# Altium schematic sheet SixPak Ultra.SchDoc
size 863 x 558 mm; SheetNumber: 1; SheetTotal: 1
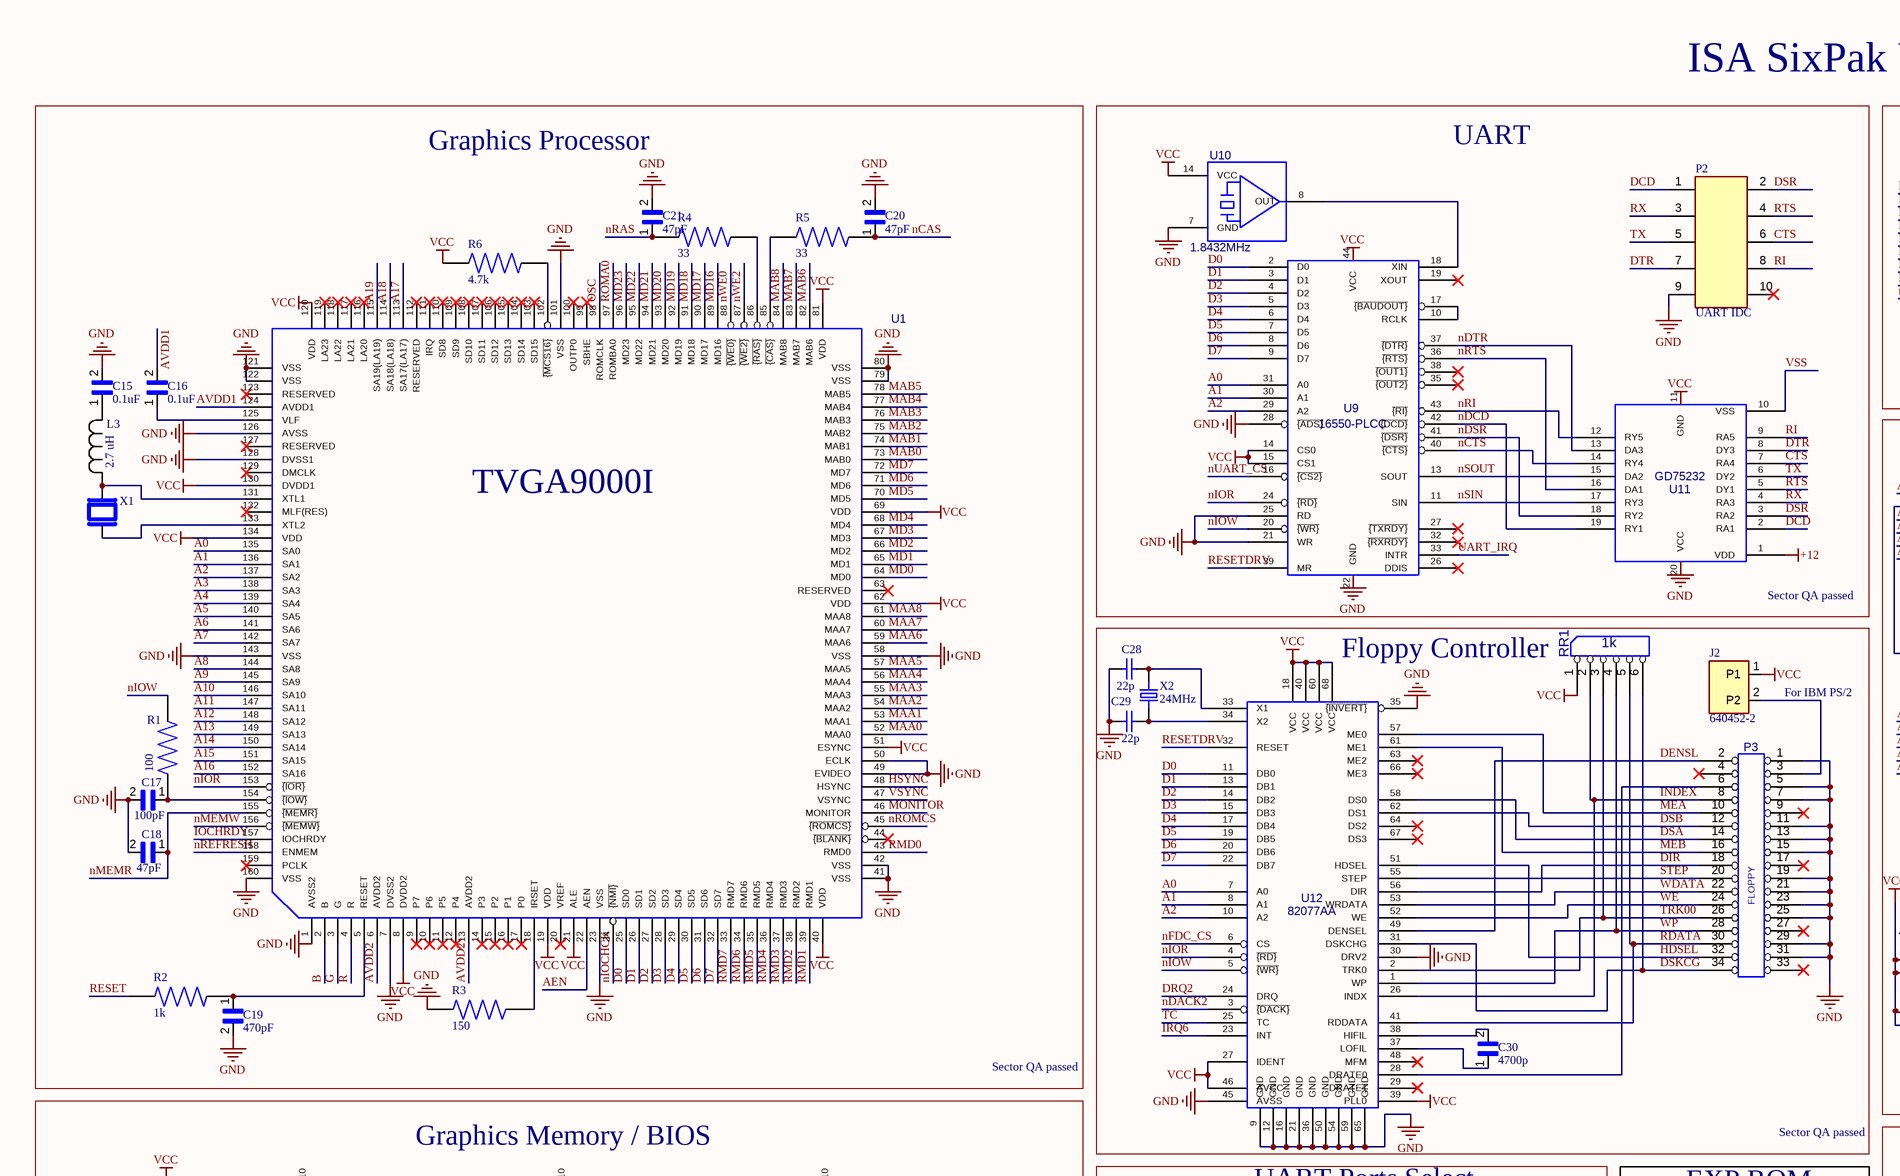
[diagram p0: SixPak Ultra.SchDoc, top left]
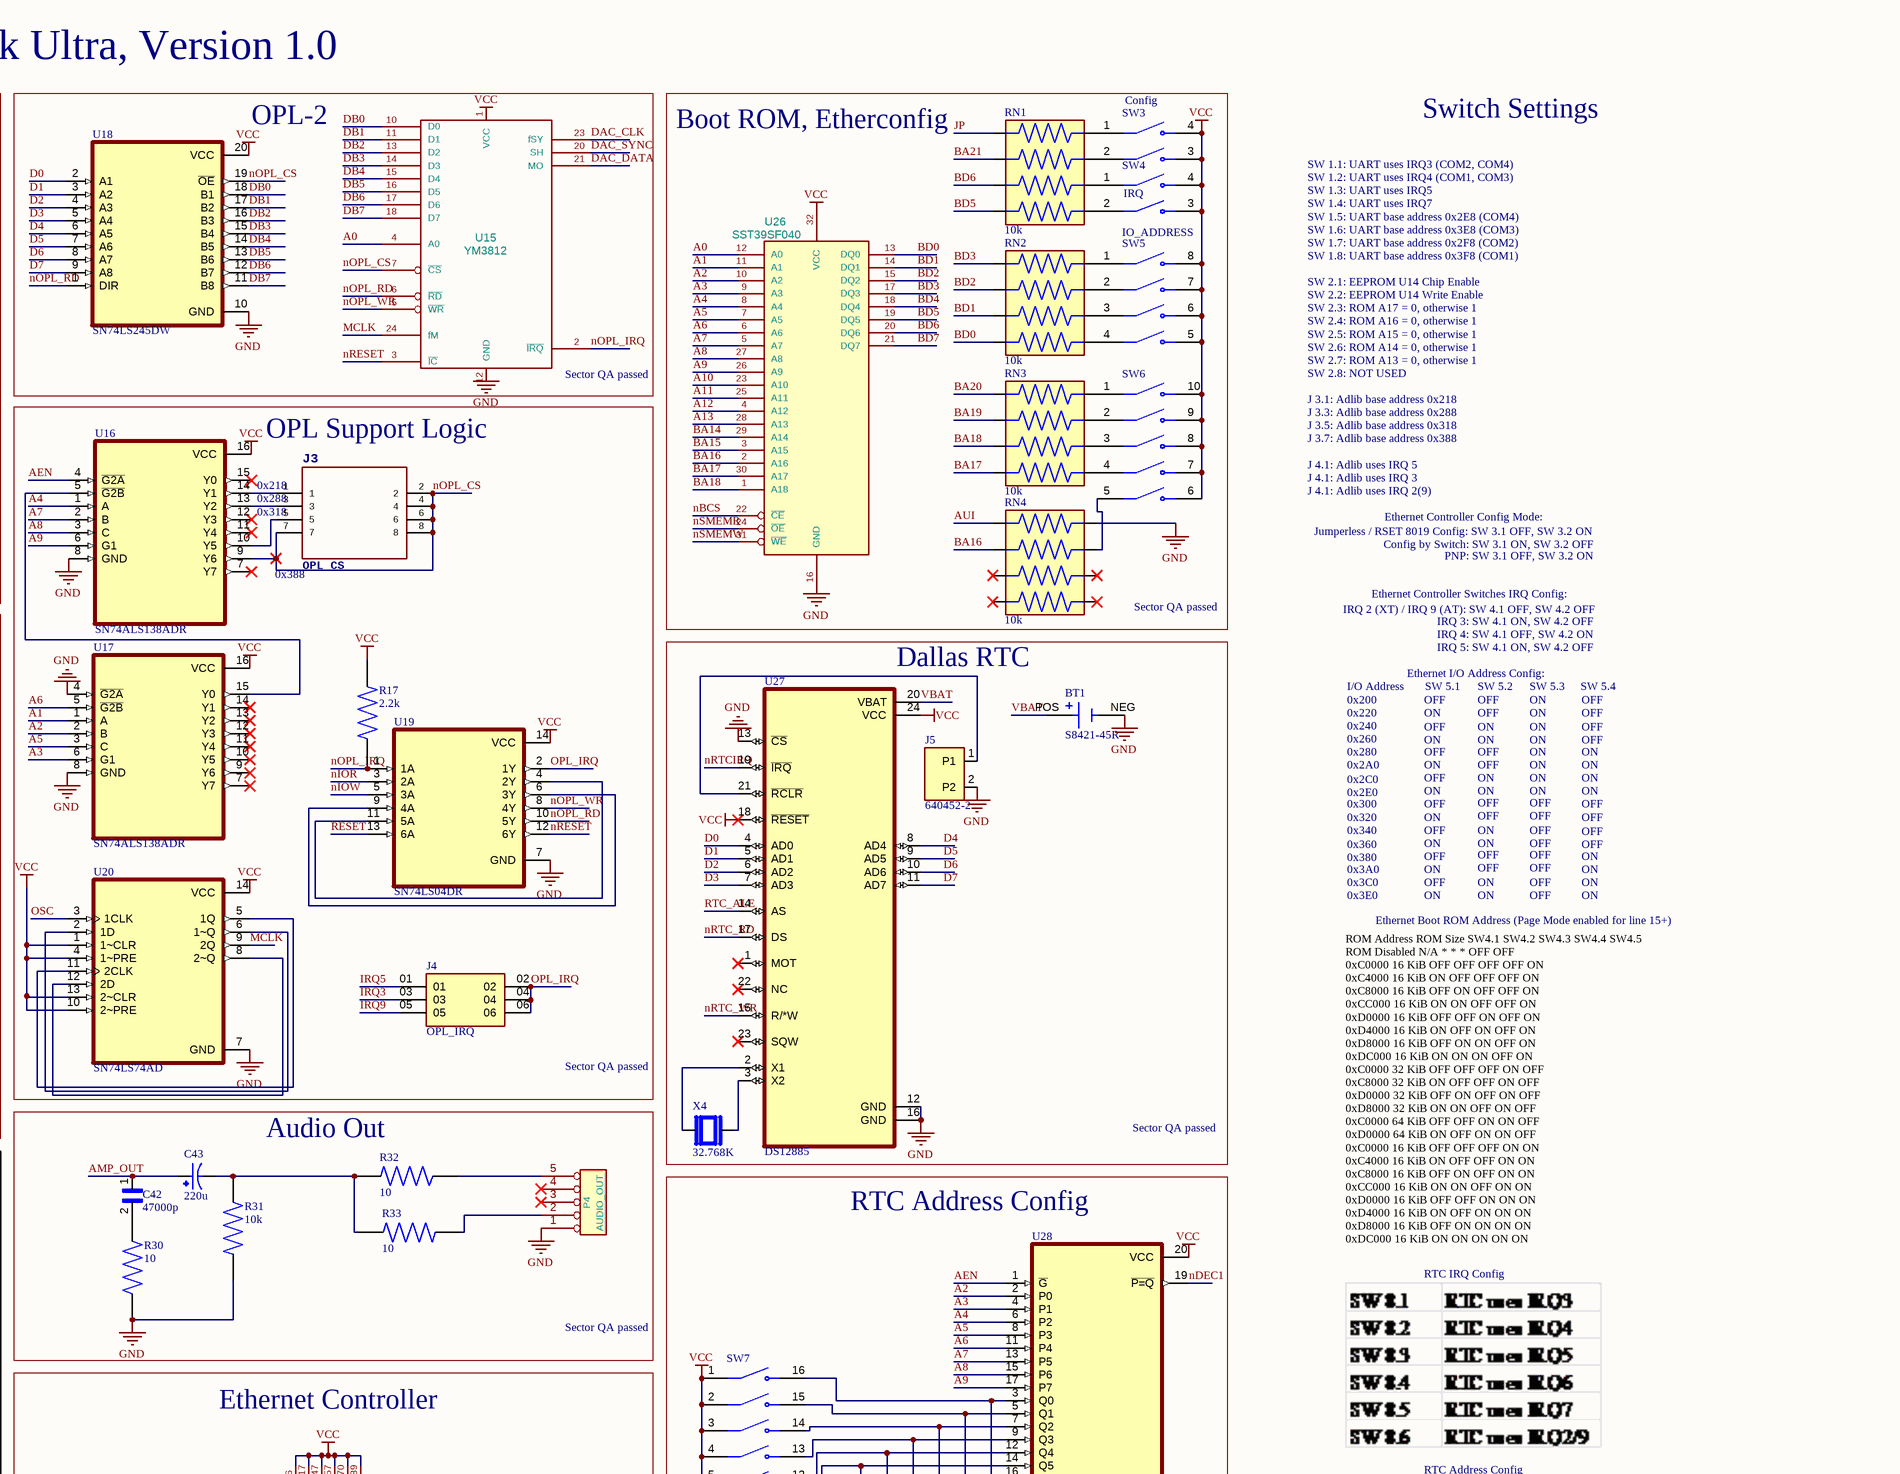
[diagram p1: SixPak Ultra.SchDoc, top right]
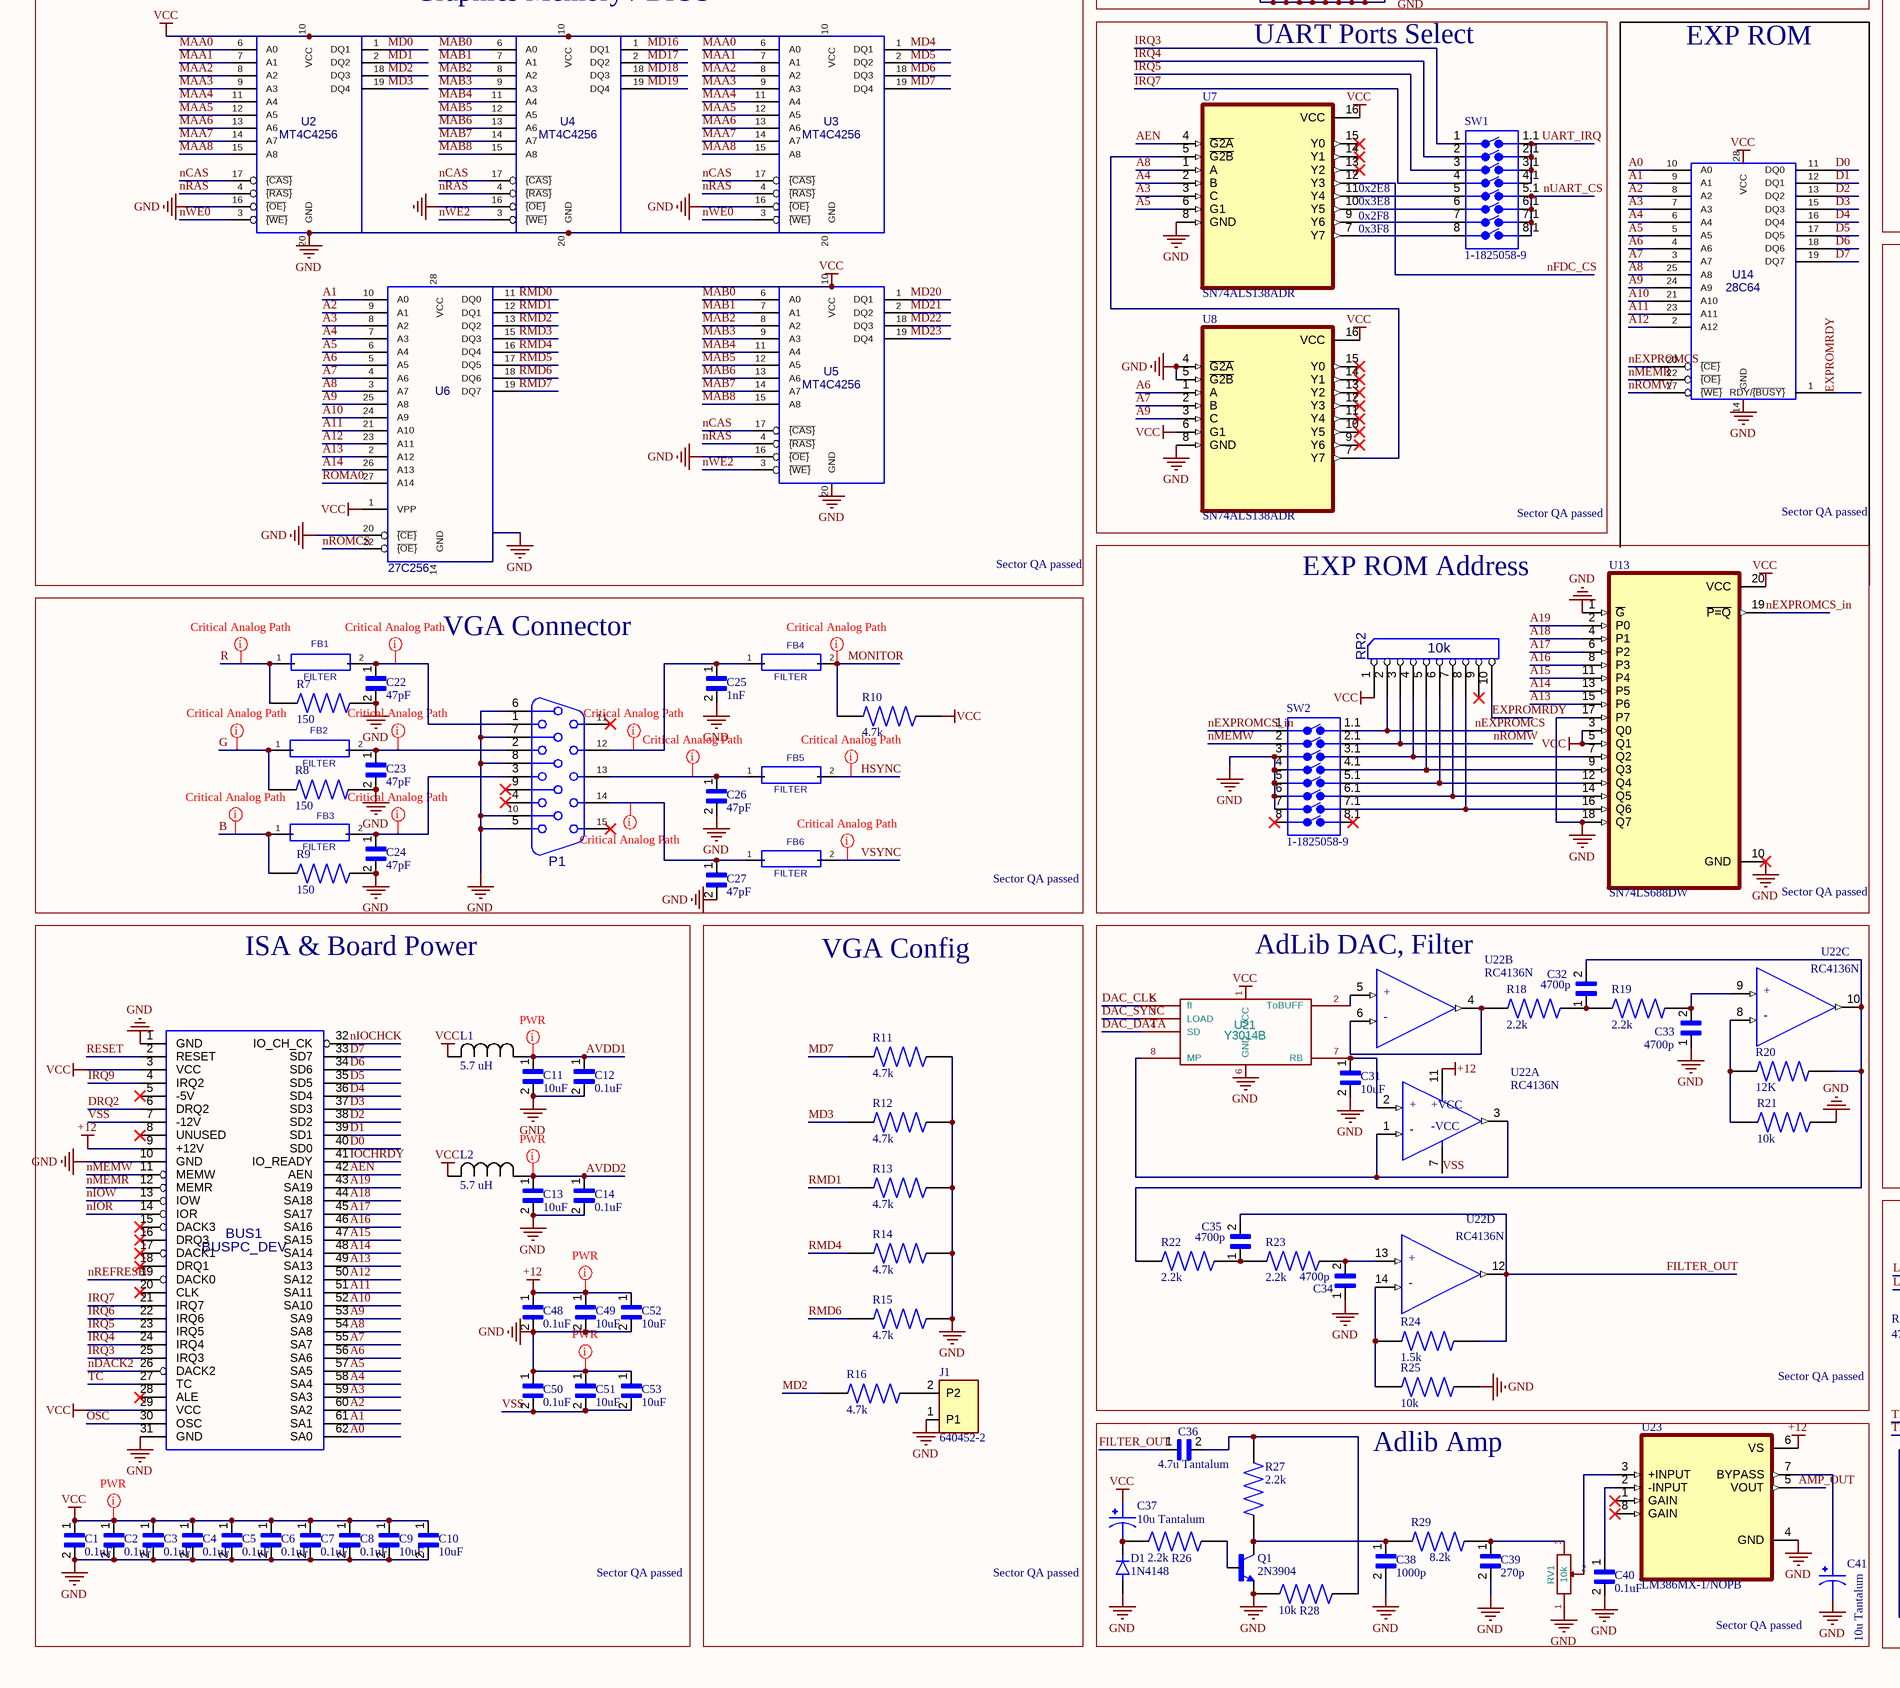
[diagram p2: SixPak Ultra.SchDoc, bottom left]
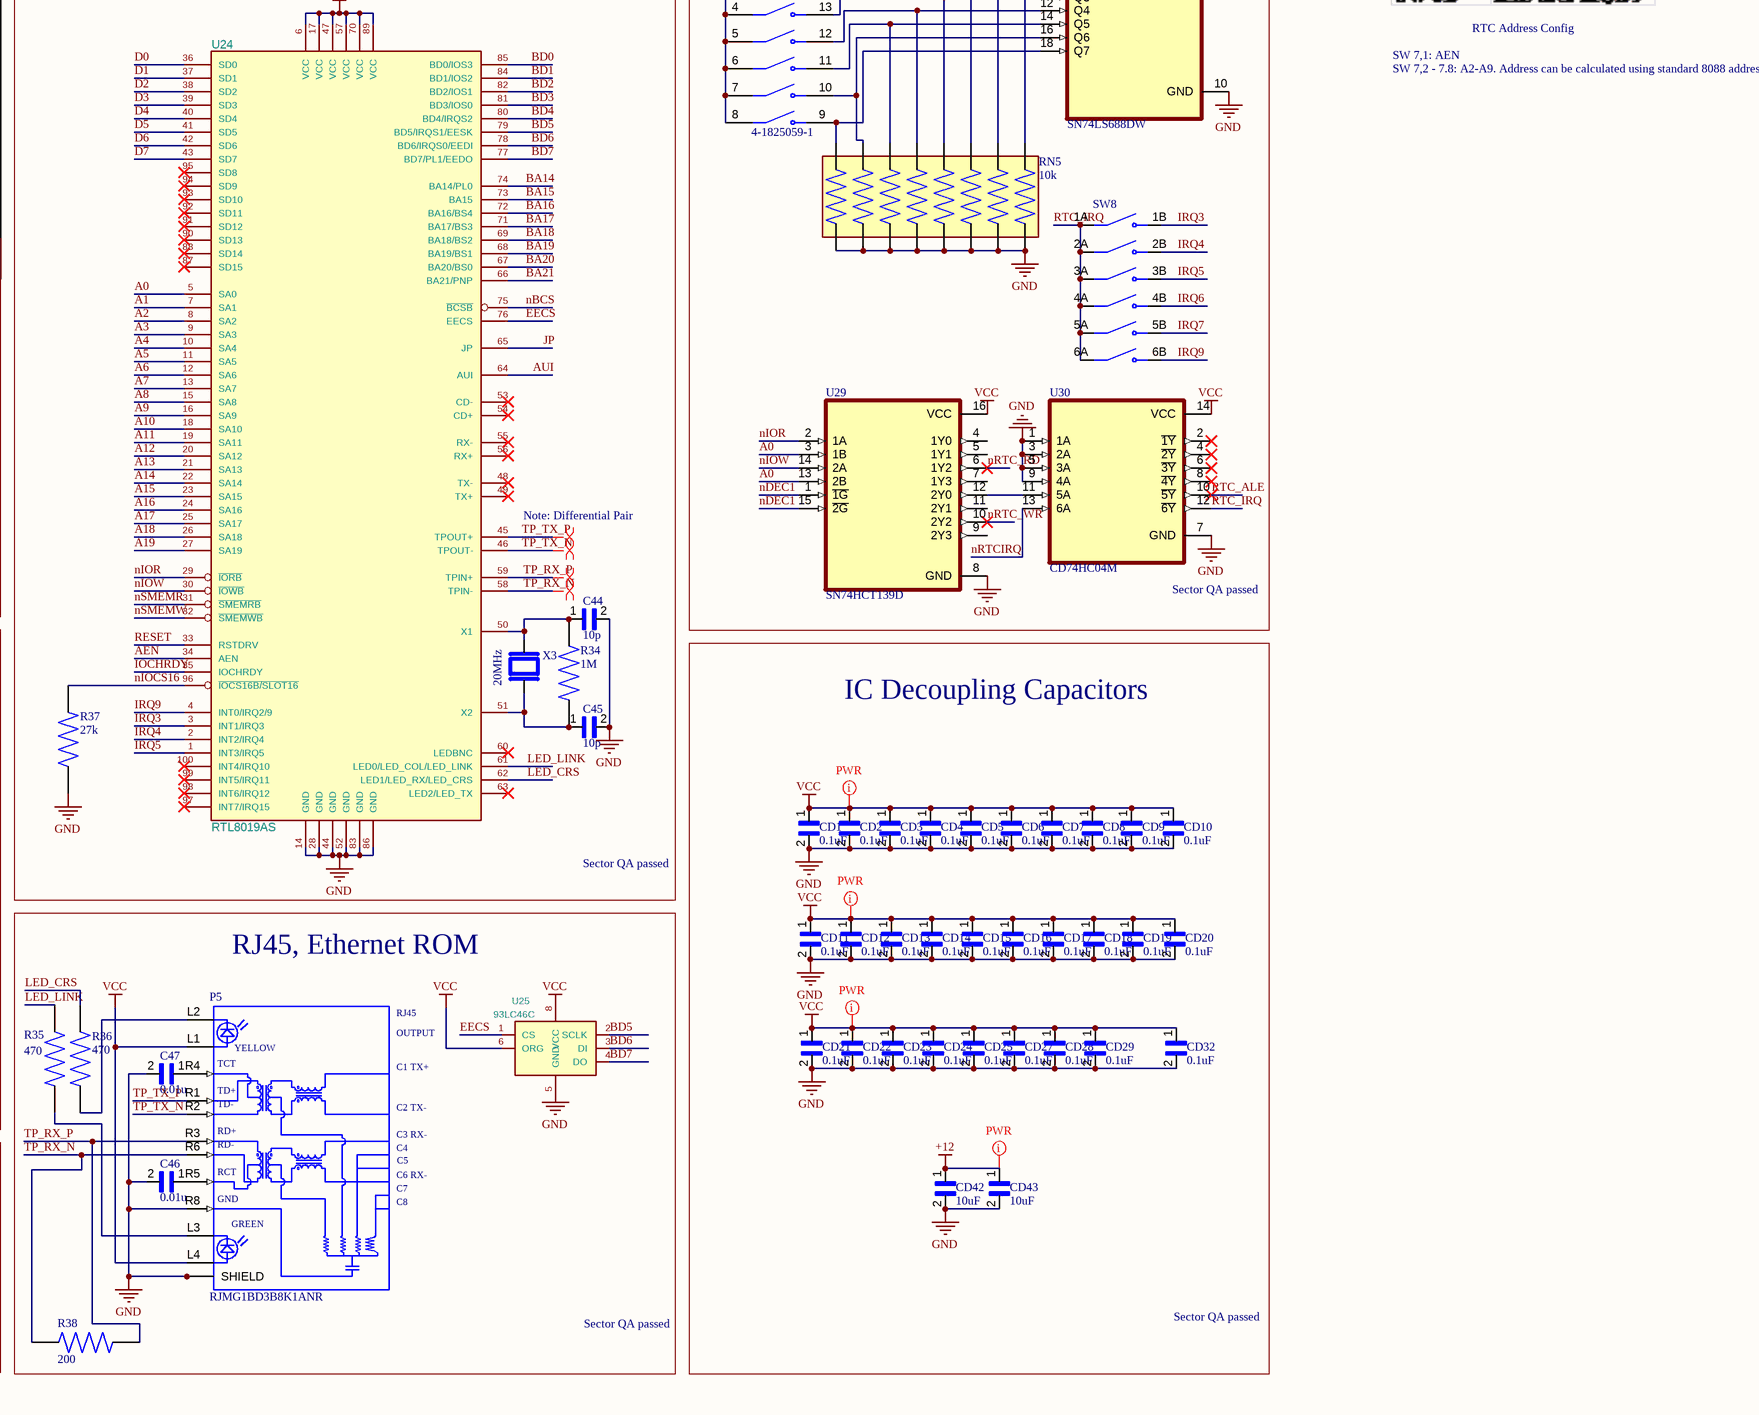
[diagram p3: SixPak Ultra.SchDoc, bottom right]

## Parts
BT1  S8421-45R  [BAT_S8421-45R]
BUS1  BUSPC_DEV  [Conn_Bus_ISA8]
C1  0.1uF  [CAPC2012X140N]
C2  0.1uF  [CAPC2012X140N]
C3  0.1uF  [CAPC2012X140N]
C4  0.1uF  [CAPC2012X140N]
C5  0.1uF  [CAPC2012X140N]
C6  0.1uF  [CAPC2012X140N]
C7  0.1uF  [CAPC2012X140N]
C8  0.1uF  [CAPC2012X140N]
C9  10uF  [CAPC2012X140N]
C10  10uF  [CAPC2012X140N]
C11  10uF  [CAPC2012X140N]
C12  0.1uF  [CAPC2012X140N]
C13  10uF  [CAPC2012X140N]
C14  0.1uF  [CAPC2012X140N]
C15  0.1uF  [CAPC2012X145N]
C16  0.1uF  [CAPC2012X145N]
C17  100pF  [CAPC2012X88N]
C18  47pF  [CAPC2012X94N]
C19  470pF  [CAPC2012X94N]
C20  47pF  [CAPC2012X94N]
C21  47pF  [CAPC2012X94N]
C22  47pF  [CAPC2012X94N]
C23  47pF  [CAPC2012X94N]
C24  47pF  [CAPC2012X94N]
C25  1nF  [CAPC2012X70]
C26  47pF  [CAPC2012X94N]
C27  47pF  [CAPC2012X94N]
C28  22p  [CAPC2013X145X50NL20T20]
C29  22p  [CAPC2013X145X50NL20T20]
C30  4700p  [CAPC2012X100N]
C31  10uF  [CAPC2012X140N]
C32  4700p  [CAPC2012X100N]
C33  4700p  [CAPC2012X100N]
C34  4700p  [CAPC2012X100N]
C35  4700p  [CAPC2012X100N]
C36  4.7u Tantalum  [CAPC2012X140N]
C37  10u Tantalum  [CAPPM6032X280N]
C38  1000p  [CAPC2012X94N]
C39  270p  [CAPC2012X88N]
C40  0.1uF  [CAPC2012X140N]
C41  10u Tantalum  [CAPPM6032X280N]
C42  47000p  [CAPC2012X75N]
C43  220u  [CAPPRD350W60D800H1150]
C44  10p  [CAPC2012X88N]
C45  10p  [CAPC2012X88N]
C46  0.01u  [CAPC2012X88N]
C47  0.01u  [CAPC2012X88N]
C48  0.1uF  [CAPC2012X140N]
C49  10uF  [CAPC2012X140N]
C50  0.1uF  [CAPC2012X140N]
C51  10uF  [CAPC2012X140N]
C52  10uF  [CAPC2012X140N]
C53  10uF  [CAPC2012X140N]
CD1  0.1uF  [CAPC2012X140N]
CD2  0.1uF  [CAPC2012X140N]
CD3  0.1uF  [CAPC2012X140N]
CD4  0.1uF  [CAPC2012X140N]
CD5  0.1uF  [CAPC2012X140N]
CD6  0.1uF  [CAPC2012X140N]
CD7  0.1uF  [CAPC2012X140N]
CD8  0.1uF  [CAPC2012X140N]
CD9  0.1uF  [CAPC2012X140N]
CD10  0.1uF  [CAPC2012X140N]
CD11  0.1uF  [CAPC2012X140N]
CD12  0.1uF  [CAPC2012X140N]
CD13  0.1uF  [CAPC2012X140N]
CD14  0.1uF  [CAPC2012X140N]
CD15  0.1uF  [CAPC2012X140N]
CD16  0.1uF  [CAPC2012X140N]
CD17  0.1uF  [CAPC2012X140N]
CD18  0.1uF  [CAPC2012X140N]
CD19  0.1uF  [CAPC2012X140N]
CD20  0.1uF  [CAPC2012X140N]
CD21  0.1uF  [CAPC2012X140N]
CD22  0.1uF  [CAPC2012X140N]
CD23  0.1uF  [CAPC2012X140N]
CD24  0.1uF  [CAPC2012X140N]
CD25  0.1uF  [CAPC2012X140N]
CD27  0.1uF  [CAPC2012X140N]
CD28  0.1uF  [CAPC2012X140N]
CD29  0.1uF  [CAPC2012X140N]
CD32  0.1uF  [CAPC2012X140N]
CD42  10uF  [CAPC2012X140N]
CD43  10uF  [CAPC2012X140N]
D1  1N4148  [DIOAD829W49L456D191]
FB1  FILTER  [FILTER]
FB2  FILTER  [FILTER]
FB3  FILTER  [FILTER]
FB4  FILTER  [FILTER]
FB5  FILTER  [FILTER]
FB6  FILTER  [FILTER]
J1  640452-2  [TE_640452-2]
J2  640452-2  [TE_640452-2]
J3  OPL CS  [SAMTEC-TSM-104-01-X-DV-A]
J4  OPL_IRQ  [SAMTEC_TSM-103-01-T-DV]
J5  640452-2  [TE_640452-2]
L1  5.7 uH  [IND_BOURNS_78F]
L2  5.7 uH  [IND_BOURNS_78F]
L3  2.7 uH  [IND_BOURNS_78F]
P1  VGA  [VGA_Conn]  (value not drawn)
P2  UART IDC  [61201021621]
P3  FLOPPY  [Floppy Connector]
P4  AUDIO_OUT  [Headphone]
P5  RJMG1BD3B8K1ANR  [CONN_RJMG1BD3B8K1ANR]
Q1  2N3904  [TO92127P495H495-3]
R1  100  [RES_ERJ6ENF1000V]
R2  1k  [RESC2012X60N]
R3  150  [RESC2012X70N]
R4  33  [RESC2012X65N]
R5  33  [RESC2012X65N]
R6  4.7k  [RESC2012X60N]
R7  150  [RESC2012X70N]
R8  150  [RESC2012X70N]
R9  150  [RESC2012X70N]
R10  4.7k  [RESC2012X60N]
R11  4.7k  [RESC2012X60N]
R12  4.7k  [RESC2012X60N]
R13  4.7k  [RESC2012X60N]
R14  4.7k  [RESC2012X60N]
R15  4.7k  [RESC2012X60N]
R16  4.7k  [RESC2012X60N]
R17  2.2k  [RESC2012X60N]
R18  2.2k  [RESC2012X70N]
R19  2.2k  [RESC2012X70N]
R20  12K  [RESC2012X70N]
R21  10k  [RESC2012X70N]
R22  2.2k  [RESC2012X70N]
R23  2.2k  [RESC2012X70N]
R24  1.5k  [RESC2012X70N]
R25  10k  [RESC2012X70N]
R26  2.2k  [RESC2012X70N]
R27  2.2k  [RESC2012X70N]
R28  10k  [RESC2012X70N]
R29  8.2k  [RESC2012X70N]
R30  10  [RESC2012X70N]
R31  10k  [RESC2012X70N]
R32  10  [RESC2012X70N]
R33  10  [RESC2012X70N]
R34  1M  [RESC2012X70N]
R35  470  [RESC2012X70N]
R36  470  [RESC2012X70N]
R37  27k  [RESC2012X60N]
R38  200  [RESC2012X70N]
RN1  10k  [RESCAXS80P320X160X60-8N]
RN2  10k  [RESCAXS80P320X160X60-8N]
RN3  10k  [RESCAXS80P320X160X60-8N]
RN4  10k  [RESCAXS80P320X160X60-8N]
RN5  10k  [SOIC127P762X240-16N]
RR1  1k  [Res Network RR2 Floppy]
RR2  10k  [Res Network RR1 Floppy ROM]
RV1  10k  [Potentiometer]
SW1  1-1825058-9  [SW_1-1825058-9]
SW2  1-1825058-9  [SW_1-1825058-9]
SW3  1825059-1  [SW_1825059-1]  (value not drawn)
SW4  1825059-1  [SW_1825059-1]  (value not drawn)
SW5  1-1825059-7  [SW_1-1825059-7]  (value not drawn)
SW6  2-1825059-3  [SW_2-1825059-3]  (value not drawn)
SW7  4-1825059-1  [SW_4-1825059-1]
SW8  DS04-254-2-06BK-SMT-TR  [SW_DS04-254-2-06BK-SMT-TR]  (value not drawn)
U1  TVGA9000I  [TVGA9000]
U2  MT4C4256  [MT4C4256]
U3  MT4C4256  [MT4C4256]
U4  MT4C4256  [MT4C4256]
U5  MT4C4256  [MT4C4256]
U6  27C256  [27C256]
U7  SN74ALS138ADR  [SOIC127P600X175-16N]
U8  SN74ALS138ADR  [SOIC127P600X175-16N]
U9  16550-PLCC  [16550_PLCC]
U10  1.8432MHz  [Osc_Socket 4PIN]
U11  GD75232  [GD75232]
U12  82077AA  [82077AA]
U13  SN74LS688DW  [SOIC127P1030X265-20N]
U14  28C64  [27C256]
U15  YM3812  [YM3812]
U16  SN74ALS138ADR  [SOIC127P600X175-16N]
U17  SN74ALS138ADR  [SOIC127P600X175-16N]
U18  SN74LS245DW  [SOIC127P1030X265-20N]
U19  SN74LS04DR  [SOIC127P600X175-14N]
U20  SN74LS74AD  [SOIC127P600X175-14N]
U21  Y3014B  [Y3014B]
U22  RC4136N  [DIP794W45P254L1969H508Q14]  (parts A,B,C,D of 4)
U23  LM386MX-1/NOPB  [SOIC127P599X175-8N]
U24  RTL8019AS  [Ethernet Controller]
U25  93LC46C  [93LC46C]
U26  SST39SF040  [SST39LF040]
U27  DS12885  [DIP1524W46P254L3226H508Q24]
U28  SN74LS688DW  [SOIC127P1030X265-20N]
U29  SN74HCT139D  [SOIC127P600X175-16N]
U30  CD74HC04M  [SOIC127P600X175-14N]
X1  ABM3-40.000MHZ-B2-T  [XTAL_ABM3-40.000MHZ-B2-T]  (value not drawn)
X2  24MHz  [XTAL_ECS-240-12-20A-TR]
X3  20MHz  [XTAL_ABM3-20.000MHZ-B2-T]
X4  32.768K  [XTAL_MS1V-T1K-32.768KHZ-7PF-20PPM-TA-QC-AU]

## Blocks framed on the sheet
Graphics Processor: C15-C21 L3 R1-R6 U1 X1
UART: P2 U9-U11
OPL-2: U15 U18
Boot ROM, Etherconfig: RN1-RN4 SW3-SW6 U26
OPL Support Logic: J3 J4 R17 U16 U17 U19 U20
Floppy Controller: C28-C30 J2 P3 RR1 U12 X2
Dallas RTC: BT1 J5 U27 X4
Graphics Memory / BIOS: U2-U6
Audio Out: C42 C43 P4 R30-R33
UART Ports Select: SW1 U7 U8
RTC Address Config: RN5 SW7 SW8 U28-U30
Ethernet Controller: C44 C45 R34 R37 U24 X3
EXP ROM Address: RR2 SW2 U13
VGA Connector: C22-C27 FB1-FB6 P1 R7-R10
ISA & Board Power: BUS1 C1-C14 C48-C53 L1 L2
VGA Config: J1 R11-R16
AdLib DAC, Filter: C31-C35 R18-R25 U21 U22
IC Decoupling Capacitors: CD1-CD25 CD27-CD29 CD32 CD42 CD43
RJ45, Ethernet ROM: C46 C47 P5 R35 R36 R38 U25
Adlib Amp: C36-C41 D1 Q1 R26-R29 RV1 U23

## Nets
+12: BUS1.9(+12V) C48.1 C49.1 C52.1 CD42.1 CD43.1 U11.1(VDD) U22.11(VCC+) U23.6(VS)
GND: BT1.NEG BUS1.1(GND) BUS1.10(GND) BUS1.31(GND) C1.2 C2.2 C3.2 C4.2 C5.2 C6.2 C7.2 C8.2 C9.2 C10.2 C11.2 C12.2 C13.2 C14.2 C15.2 C17.2 C18.2 C19.2 C20.2 C21.2 C22.2 C23.2 C24.2 C25.2 C26.2 C27.2 C28.1 C29.1 C31.2 C33.1 C34.1 C38.2 C39.2 C40.2 C41.2 C44.2 C45.2 C46.2 C47.2 C48.2 C49.2 C50.1 C51.1 C52.2 C53.1 CD1.2 CD2.2 CD3.2 CD4.2 CD5.2 CD6.2 CD7.2 CD8.2 CD9.2 CD10.2 CD11.2 CD12.2 CD13.2 CD14.2 CD15.2 CD16.2 CD17.2 CD18.2 CD19.2 CD20.2 CD21.2 CD22.2 CD23.2 CD24.2 CD25.2 CD27.2 CD28.2 CD29.2 CD32.2 CD42.2 CD43.2 D1.A J1.1(P1) J5.2(P2) P1.5 P1.6(P6) P1.7(P7) P1.8(P8) P1.10 P2.9 P3.1(P1) P3.5(P5) P3.7(P7) P3.11(P11) P3.13(P13) P3.15(P15) P3.19(P19) P3.21(P21) P3.23(P23) P3.25 P3.29(P29) P3.31(P31) P4.1 P5.1(SHIELD) P5.2(SHIELD) P5.R8(GND) Q1.1(E) R3.2 R7.1 R8.1 R9.1 R11.2 R12.2 R13.2 R14.2 R15.2 R21.2 R25.2 R28.2 R30.1 R31.1 R37.1 RN4.8 RN5.1 RN5.2 RN5.3 RN5.4 RN5.5 RN5.6 RN5.7 RN5.8 RV1.1 SW2.3 SW2.4 SW2.5 SW2.6 SW2.7 U1.1(AVSS2) U1.7(DVSS2) U1.23(VSS) U1.41(VSS) U1.42(VSS) U1.49(EVIDEO) U1.50(ECLK) U1.58(VSS) U1.79(VSS) U1.80(VSS) U1.101(VSS) U1.121(VSS) U1.122(VSS) U1.126(AVSS) U1.128(DVSS1) U1.143(VSS) U1.160(VSS) U2.16(~{{OE}}) U2.20(GND) U3.16(~{{OE}}) U3.20(GND) U4.16(~{{OE}}) U4.20(GND) U5.16(~{{OE}}) U5.20(GND) U6.14(GND) U6.20(~{{CE}}) U7.8(GND) U8.4(~{G2A}) U8.5(~{G2B}) U8.8(GND) U9.21(WR) U9.22(GND) U9.25(RD) U9.28(~{{ADS}}) U10.7(GND) U11.20(VCC) U12.9(GND) U12.12(GND) U12.16(GND) U12.21(GND) U12.30(DRV2) U12.35(~{{INVERT}}) U12.36(GND) U12.45(AVSS) U12.50(GND) U12.54(GND) U12.59(GND) U12.65(GND) U13.1(~{G}) U13.10(GND) U13.17(P7) U13.18(Q7) U14.14(GND) U15.12(GND) U16.8(GND) U17.4(~{G2A}) U17.8(GND) U18.10(GND) U19.7(GND) U20.7(GND) U21.6(GND) U23.4(GND) U24.14(GND) U24.28(GND) U24.44(GND) U24.52(GND) U24.83(GND) U24.86(GND) U25.5(GND) U26.16(GND) U27.12(GND) U27.13(~{CS}) U27.16(GND) U28.10(GND) U29.8(GND) U30.1(1A) U30.3(2A) U30.5(3A) U30.7(GND) U30.9(4A)
VCC: BUS1.3(VCC) BUS1.29(VCC) C1.1 C2.1 C3.1 C4.1 C5.1 C6.1 C7.1 C8.1 C9.1 C10.1 C37.1 CD1.1 CD2.1 CD3.1 CD4.1 CD5.1 CD6.1 CD7.1 CD8.1 CD9.1 CD10.1 CD11.1 CD12.1 CD13.1 CD14.1 CD15.1 CD16.1 CD17.1 CD18.1 CD19.1 CD20.1 CD21.1 CD22.1 CD23.1 CD24.1 CD25.1 CD27.1 CD28.1 CD29.1 CD32.1 J2.1(P1) L1.2 L2.2 P5.L1 P5.L4 R6.1 R10.2 R17.1 RR1.1(COM) RR2.1(COM) SW3.3 SW3.4 SW4.3 SW4.4 SW5.5 SW5.6 SW5.7 SW5.8 SW6.6 SW6.7 SW6.8 SW6.9 SW6.10 SW7.1 SW7.2 SW7.3 SW7.4 SW7.5 SW7.6 SW7.7 SW7.8 U1.8(DVDD2) U1.19(VDD) U1.21(ALE) U1.40(VDD) U1.51(ESYNC) U1.62(VDD) U1.69(VDD) U1.81(VDD) U1.120(VDD) U1.130(DVDD1) U1.134(VDD) U2.10(VCC) U3.10(VCC) U4.10(VCC) U5.10(VCC) U6.1(VPP) U6.28(VCC) U7.16(VCC) U8.6(G1) U8.16(VCC) U9.14(CS0) U9.15(CS1) U9.44(VCC) U10.14(VCC) U11.11(GND) U12.18(VCC) U12.27(IDENT) U12.39(PLL0) U12.40(VCC) U12.46(AVCC) U12.60(VCC) U12.68(VCC) U13.3(Q0) U13.5(Q1) U13.20(VCC) U14.28(VCC) U15.1(VCC) U16.16(VCC) U17.16(VCC) U18.20(VCC) U19.14(VCC) U20.1(1~CLR) U20.4(1~PRE) U20.10(2~PRE) U20.13(2~CLR) U20.14(VCC) U21.1(VCC) U24.6(VCC) U24.17(VCC) U24.47(VCC) U24.57(VCC) U24.70(VCC) U24.89(VCC) U25.6(ORG) U25.8(VCC) U26.32(VCC) U27.18(~{RESET}) U27.24(VCC) U28.20(VCC) U29.16(VCC) U30.14(VCC)
A0: BUS1.62(SA0) U1.135(SA0) U9.31(A0) U12.7(A0) U14.10(A0) U15.4(A0) U24.5(SA0) U26.12(A0) U29.3(1B) U29.13(2B)
A1: BUS1.61(SA1) U1.136(SA1) U6.10(A0) U9.30(A1) U12.8(A1) U14.9(A1) U17.1(A) U24.7(SA1) U26.11(A1)
A2: BUS1.60(SA2) U1.137(SA2) U6.9(A1) U9.29(A2) U12.10(A2) U14.8(A2) U17.2(B) U24.8(SA2) U26.10(A2) U28.2(P0)
A3: BUS1.59(SA3) U1.138(SA3) U6.8(A2) U7.3(C) U14.7(A3) U17.6(G1) U24.9(SA3) U26.9(A3) U28.4(P1)
A4: BUS1.58(SA4) U1.139(SA4) U6.7(A3) U7.2(B) U14.6(A4) U16.1(A) U24.10(SA4) U26.8(A4) U28.6(P2)
A5: BUS1.57(SA5) U1.140(SA5) U6.6(A4) U7.6(G1) U14.5(A5) U17.3(C) U24.11(SA5) U26.7(A5) U28.8(P3)
A6: BUS1.56(SA6) U1.141(SA6) U6.5(A5) U8.1(A) U14.4(A6) U17.5(~{G2B}) U24.12(SA6) U26.6(A6) U28.11(P4)
A7: BUS1.55(SA7) U1.142(SA7) U6.4(A6) U8.2(B) U14.3(A7) U16.2(B) U24.13(SA7) U26.5(A7) U28.13(P5)
A8: BUS1.54(SA8) U1.144(SA8) U6.3(A7) U7.1(A) U14.25(A8) U16.3(C) U24.15(SA8) U26.27(A8) U28.15(P6)
A9: BUS1.53(SA9) U1.145(SA9) U6.25(A8) U8.3(C) U14.24(A9) U16.6(G1) U24.16(SA9) U26.26(A9) U28.17(P7)
A10: BUS1.52(SA10) U1.146(SA10) U6.24(A9) U14.21(A10) U24.18(SA10) U26.23(A10)
A11: BUS1.51(SA11) U1.147(SA11) U6.21(A10) U14.23(A11) U24.19(SA11) U26.25(A11)
A12: BUS1.50(SA12) U1.148(SA12) U6.23(A11) U14.2(A12) U24.20(SA12) U26.4(A12)
A13: BUS1.49(SA13) U1.149(SA13) U6.2(A12) U13.15(P6) U24.21(SA13) U26.28(A13)
A14: BUS1.48(SA14) U1.150(SA14) U6.26(A13) U13.13(P5) U24.22(SA14)
A15: BUS1.47(SA15) U1.151(SA15) U13.11(P4) U24.23(SA15)
A16: BUS1.46(SA16) U1.152(SA16) U13.8(P3) U24.24(SA16)
A17: BUS1.45(SA17) U1.113(SA17(LA17)) U13.6(P2) U24.25(SA17)
A18: BUS1.44(SA18) U1.114(SA18(LA18)) U13.4(P1) U24.26(SA18)
A19: BUS1.43(SA19) U1.115(SA19(LA19)) U13.2(P0) U24.27(SA19)
AEN: BUS1.42(AEN) U1.22(AEN) U7.4(~{G2A}) U16.4(~{G2A}) U24.34(AEN) U28.1(~{G})
AMP_OUT: C42.1 C43.P U23.5(VOUT)
AUI: RN4.1 U24.64(AUI)
AVDD1: C11.1 C12.1 C16.2 L1.1 U1.124(AVDD1)
AVDD2: C13.1 C14.1 L2.1 U1.6(AVDD2) U1.13(AVDD2)
B: FB3.1 R9.2 U1.2(B)
BA14: U24.74(BA14/PL0) U26.29(A14)
BA15: U24.73(BA15) U26.3(A15)
BA16: RN4.2 U24.72(BA16/BS4) U26.2(A16)
BA17: RN3.4 U24.71(BA17/BS3) U26.30(A17)
BA18: RN3.3 U24.69(BA18/BS2) U26.1(A18)
BA19: RN3.2 U24.68(BA19/BS1)
BA20: RN3.1 U24.67(BA20/BS0)
BA21: RN1.2 U24.66(BA21/PNP)
BD0: RN2.4 U24.85(BD0/IOS3) U26.13(DQ0)
BD1: RN2.3 U24.84(BD1/IOS2) U26.14(DQ1)
BD2: RN2.2 U24.82(BD2/IOS1) U26.15(DQ2)
BD3: RN2.1 U24.81(BD3/IOS0) U26.17(DQ3)
BD4: U24.80(BD4/IRQS2) U26.18(DQ4)
BD5: RN1.4 U24.79(BD5/IRQS1/EESK) U25.2(SCLK) U26.19(DQ5)
BD6: RN1.3 U24.78(BD6/IRQS0/EEDI) U25.3(DI) U26.20(DQ6)
BD7: U24.77(BD7/PL1/EEDO) U25.4(DO) U26.21(DQ7)
CTS: P2.6 U11.7(RA4)
D0: BUS1.40(SD0) U1.25(SD0) U9.2(D0) U12.11(DB0) U14.11(DQ0) U18.2(A1) U24.36(SD0) U27.4(AD0)
D1: BUS1.39(SD1) U1.26(SD1) U9.3(D1) U12.13(DB1) U14.12(DQ1) U18.3(A2) U24.37(SD1) U27.5(AD1)
D2: BUS1.38(SD2) U1.27(SD2) U9.4(D2) U12.14(DB2) U14.13(DQ2) U18.4(A3) U24.38(SD2) U27.6(AD2)
D3: BUS1.37(SD3) U1.28(SD3) U9.5(D3) U12.15(DB3) U14.15(DQ3) U18.5(A4) U24.39(SD3) U27.7(AD3)
D4: BUS1.36(SD4) U1.29(SD4) U9.6(D4) U12.17(DB4) U14.16(DQ4) U18.6(A5) U24.40(SD4) U27.8(AD4)
D5: BUS1.35(SD5) U1.30(SD5) U9.7(D5) U12.19(DB5) U14.17(DQ5) U18.7(A6) U24.41(SD5) U27.9(AD5)
D6: BUS1.34(SD6) U1.31(SD6) U9.8(D6) U12.20(DB6) U14.18(DQ6) U18.8(A7) U24.42(SD6) U27.10(AD6)
D7: BUS1.33(SD7) U1.32(SD7) U9.9(D7) U12.22(DB7) U14.19(DQ7) U18.9(A8) U24.43(SD7) U27.11(AD7)
DAC_CLK: U15.23(fSY) U21.5(fI)
DAC_DATA: U15.21(MO) U21.4(SD)
DAC_SYNC: U15.20(SH) U21.3(LOAD)
DB0: U15.10(D0) U18.18(B1)
DB1: U15.11(D1) U18.17(B2)
DB2: U15.13(D2) U18.16(B3)
DB3: U15.14(D3) U18.15(B4)
DB4: U15.15(D4) U18.14(B5)
DB5: U15.16(D5) U18.13(B6)
DB6: U15.17(D6) U18.12(B7)
DB7: U15.18(D7) U18.11(B8)
DCD: P2.1 U11.2(RA1)
DENSL: P3.2(P2) U12.49(DENSEL)
DIR: P3.18(P18) U12.56(DIR)
DRQ2: BUS1.6(DRQ2) U12.24(DRQ)
DSA: P3.14(P14) U12.58(DS0)
DSB: P3.12(P12) U12.62(DS1)
DSKCG: P3.34(P34) RR1.6 U12.31(DSKCHG)
DSR: P2.2 U11.3(RA2)
DTR: P2.7 U11.8(DY3)
EECS: U24.76(EECS) U25.1(CS)
EXPROMRDY: RR2.10 U14.1(RDY/~{{BUSY}})
FILTER_OUT: C35.2 C36.1 R24.2 U22.12(OUT)
G: FB2.1 R8.2 U1.3(G)
HDSEL: P3.32(P32) U12.51(HDSEL)
HSYNC: FB5.2 U1.48(HSYNC)
INDEX: P3.8(P8) RR1.2 U12.26(INDX)
IOCHRDY: BUS1.41(IO_READY) U1.157(IOCHRDY) U24.35(IOCHRDY)
IRQ3: BUS1.25(IRQ3) J4.03 SW1.1 SW8.1B(NO1) U24.3(INT1/IRQ3)
IRQ4: BUS1.24(IRQ4) SW1.2 SW8.2B(NO2) U24.2(INT2/IRQ4)
IRQ5: BUS1.23(IRQ5) J4.01 SW1.3 SW8.3B(NO3) U24.1(INT3/IRQ5)
IRQ6: BUS1.22(IRQ6) SW8.4B(NO4) U12.23(INT)
IRQ7: BUS1.21(IRQ7) SW1.4 SW8.5B(NO5)
IRQ9: BUS1.4(IRQ2) J4.05 SW8.6B(NO6) U24.4(INT0/IRQ2/9)
JP: RN1.1 U24.65(JP)
LED_CRS: R36.2 U24.62(LED1/LED_RX/LED_CRS)
LED_LINK: R35.2 U24.61(LED0/LED_COL/LED_LINK)
MAA0: U1.52(MAA0) U2.6(A0) U3.6(A0)
MAA1: U1.53(MAA1) U2.7(A1) U3.7(A1)
MAA2: U1.54(MAA2) U2.8(A2) U3.8(A2)
MAA3: U1.55(MAA3) U2.9(A3) U3.9(A3)
MAA4: U1.56(MAA4) U2.11(A4) U3.11(A4)
MAA5: U1.57(MAA5) U2.12(A5) U3.12(A5)
MAA6: U1.59(MAA6) U2.13(A6) U3.13(A6)
MAA7: U1.60(MAA7) U2.14(A7) U3.14(A7)
MAA8: U1.61(MAA8) U2.15(A8) U3.15(A8)
MAB0: U1.73(MAB0) U4.6(A0) U5.6(A0)
MAB1: U1.74(MAB1) U4.7(A1) U5.7(A1)
MAB2: U1.75(MAB2) U4.8(A2) U5.8(A2)
MAB3: U1.76(MAB3) U4.9(A3) U5.9(A3)
MAB4: U1.77(MAB4) U4.11(A4) U5.11(A4)
MAB5: U1.78(MAB5) U4.12(A5) U5.12(A5)
MAB6: U1.82(MAB6) U4.13(A6) U5.13(A6)
MAB7: U1.83(MAB7) U4.14(A7) U5.14(A7)
MAB8: U1.84(MAB8) U4.15(A8) U5.15(A8)
MCLK: U15.24(fM) U20.9(2Q)
MD0: U1.64(MD0) U2.1(DQ1)
MD1: U1.65(MD1) U2.2(DQ2)
MD2: R16.1 U1.66(MD2) U2.18(DQ3)
MD3: R12.1 U1.67(MD3) U2.19(DQ4)
MD4: U1.68(MD4) U3.1(DQ1)
MD5: U1.70(MD5) U3.2(DQ2)
MD6: U1.71(MD6) U3.18(DQ3)
MD7: R11.1 U1.72(MD7) U3.19(DQ4)
MD16: U1.89(MD16) U4.1(DQ1)
MD17: U1.90(MD17) U4.2(DQ2)
MD18: U1.91(MD18) U4.18(DQ3)
MD19: U1.92(MD19) U4.19(DQ4)
MD20: U1.93(MD20) U5.1(DQ1)
MD21: U1.94(MD21) U5.2(DQ2)
MD22: U1.95(MD22) U5.18(DQ3)
MD23: U1.96(MD23) U5.19(DQ4)
MEA: P3.10(P10) U12.57(ME0)
MEB: P3.16(P16) U12.61(ME1)
MONITOR: FB4.2 R10.1 U1.46(MONITOR)
nBCS: U24.75(~{BCSB}) U26.22(~{CE})
nCAS: C20.1 R5.2 U2.17(~{{CAS}}) U3.17(~{{CAS}}) U4.17(~{{CAS}}) U5.17(~{{CAS}})
nCTS: U9.40(~{{CTS}}) U11.14(RY4)
nDACK2: BUS1.26(DACK2) U12.3(~{{DACK}})
nDCD: U9.42(~{{DCD}}) U11.19(RY1)
nDEC1: U28.19(~{P=Q}) U29.1(~{1G}) U29.15(~{2G})
nDSR: U9.41(~{{DSR}}) U11.18(RY2)
nDTR: U9.37(~{{DTR}}) U11.13(DA3)
nEXPROMCS: RR2.2 SW2.1.1 U14.20(~{{CE}})
nEXPROMCS_in: SW2.1 U13.19(~{P=Q})
nFDC_CS: U7.12(Y3) U12.6(CS)
nIOCHCK: BUS1.32(IO_CH_CK) U1.24(~{{NMI}})
nIOCS16: R37.2 U24.96(~{IOCS16B/SLOT16})
nIOR: BUS1.14(IOR) U1.153(~{{IOR}}) U9.24(~{{RD}}) U12.4(~{{RD}}) U19.3(2A) U24.29(~{IORB}) U29.2(1A)
nIOW: BUS1.13(IOW) R1.2 U9.20(~{{WR}}) U12.5(~{{WR}}) U19.5(3A) U24.30(~{IOWB}) U29.14(2A)
nMEMR: BUS1.12(MEMR) C18.1 U1.155(~{{MEMR}}) U14.22(~{{OE}})
nMEMW: BUS1.11(MEMW) SW2.2 U1.156(~{{MEMW}})
nOPL_CS: J3.2 J3.4 J3.6 J3.7 J3.8 U15.7(~{CS}) U16.9(Y6) U18.19(~{OE})
nOPL_IRQ: R17.2 U15.2(~{IRQ}) U19.1(1A)
nOPL_RD: U15.6(~{RD}) U18.1(DIR) U19.10(5Y)
nOPL_WR: U15.5(~{WR}) U19.8(4Y)
nRAS: C21.1 R4.2 U2.4(~{{RAS}}) U3.4(~{{RAS}}) U4.4(~{{RAS}}) U5.4(~{{RAS}})
nREFRESH: BUS1.19(DACK0) U1.158(ENMEM)
nRESET: U15.3(~{IC}) U19.12(6Y)
nRI: U9.43(~{{RI}}) U11.12(RY5)
nROMCS: U1.45(~{{ROMCS}}) U6.22(~{{OE}})
nROMW: RR2.3 SW2.2.1 U14.27(~{{WE}})
nRTC_RD: U27.17(DS) U29.6(1Y2)
nRTC_WR: U27.15(R/*W) U29.10(2Y2)
nRTCIRQ: U27.19(~{IRQ}) U30.13(6A)
nRTS: U9.36(~{{RTS}}) U11.16(DA1)
nSIN: U9.11(SIN) U11.17(RY3)
nSMEMR: U24.31(~{SMEMRB}) U26.24(~{OE})
nSMEMW: U24.32(~{SMEMWB}) U26.31(~{WE})
nSOUT: U9.13(SOUT) U11.15(DA2)
nUART_CS: SW1.5.1 SW1.6.1 SW1.7.1 SW1.8.1 U9.16(~{{CS2}})
nWE0: U1.88(~{{WE0}}) U2.3(~{{WE}}) U3.3(~{{WE}})
nWE2: U1.87(~{{WE2}}) U4.3(~{{WE}}) U5.3(~{{WE}})
OPL_IRQ: J4.02 J4.04 J4.06 U19.2(1Y)
OSC: BUS1.30(OSC) U1.98(ROMCLK) U20.3(1CLK)
R: FB1.1 R7.2 U1.4(R)
RDATA: P3.30(P30) RR1.5 U12.41(RDDATA)
RESET: BUS1.2(RESET) R2.1 U19.13(6A) U24.33(RSTDRV)
RESETDRV: U9.39(MR) U12.32(RESET)
RI: P2.8 U11.9(RA5)
RMD0: U1.43(RMD0) U6.11(DQ0)
RMD1: R13.1 U1.39(RMD1) U6.12(DQ1)
RMD2: U1.38(RMD2) U6.13(DQ2)
RMD3: U1.37(RMD3) U6.15(DQ3)
RMD4: R14.1 U1.36(RMD4) U6.16(DQ4)
RMD5: U1.35(RMD5) U6.17(DQ5)
RMD6: R15.1 U1.34(RMD6) U6.18(DQ6)
RMD7: U1.33(RMD7) U6.19(DQ7)
ROMA0: U1.97(ROMBA0) U6.27(A14)
RTC_ALE: U27.14(AS) U30.10(~{5Y})
RTC_IRQ: SW8.1A(COM1) SW8.2A(COM2) SW8.3A(COM3) SW8.4A(COM4) SW8.5A(COM5) SW8.6A(COM6) U30.12(~{6Y})
RTS: P2.4 U11.5(DY1)
RX: P2.3 U11.4(RA3)
STEP: P3.20(P20) U12.55(STEP)
TC: BUS1.27(TC) U12.25(TC)
TP_RX_N: P5.R6(RD-) R38.2 U24.58(TPIN-)
TP_RX_P: P5.R3(RD+) R38.1 U24.59(TPIN+)
TP_TX_N: P5.R2(TD-) U24.46(TPOUT-)
TP_TX_P: P5.R1(TD+) U24.45(TPOUT+)
TRK00: P3.26(P26) RR1.3 U12.2(TRK0)
TX: P2.5 U11.6(DY2)
UART_IRQ: SW1.1.1 SW1.2.1 SW1.3.1 SW1.4.1 U9.33(INTR)
VBAT: BT1.POS U27.20(VBAT)
VSS: BUS1.7(-12V) C50.2 C51.2 C53.2 U11.10(VSS) U22.7(VCC-)
VSYNC: FB6.2 U1.47(VSYNC)
WDATA: P3.22(P22) U12.53(WRDATA)
WE: P3.24(P24) U12.52(WE)
WP: P3.28(P28) RR1.4 U12.1(WP)
NetC15_1: C15.1 L3.1
NetC16_1: C16.1 U1.125(VLF)
NetC17_1: C17.1 R1.1 U1.154(~{{IOW}})
NetC19_1: C19.1 R2.2 U1.5(RESET)
NetC22_1: C22.1 FB1.2 P1.1
NetC23_1: C23.1 FB2.2 P1.2
NetC24_1: C24.1 FB3.2 P1.3
NetC25_1: C25.1 FB4.1 P1.12
NetC26_1: C26.1 FB5.1 P1.13
NetC27_1: C27.1 FB6.1 P1.14
NetC28_2: C28.2 U12.33(X1) X2.2
NetC29_2: C29.2 U12.34(X2) X2.1
NetC30_1: C30.1 U12.37(LOFIL)
NetC30_2: C30.2 U12.38(HIFIL)
NetC31_1: C31.1 U21.7(RB) U22.2(IN+)
NetC32_1: C32.1 R18.2 R19.1
NetC32_2: C32.2 R20.2 R22.1 U22.10(OUT)
NetC33_2: C33.2 R19.2 U22.9(IN+)
NetC34_2: C34.2 R23.2 U22.13(IN+)
NetC35_1: C35.1 R22.2 R23.1
NetC36_2: C36.2 R27.1 R28.1
NetC37_2: C37.2 D1.C R26.1
NetC38_1: C38.1 Q1.3(C) R27.2 R29.1
NetC39_1: C39.1 R29.2 RV1.3
NetC40_1: C40.1 U23.2(-INPUT)
NetC41_1: C41.1 U23.7(BYPASS)
NetC42_2: C42.2 R30.2
NetC43_N: C43.N R31.2 R32.1 R33.1
NetC44_1: C44.1 R34.2 U24.50(X1) X3.1
NetC45_1: C45.1 R34.1 U24.51(X2) X3.2
NetC46_1: C46.1 P5.R5(RCT)
NetC47_1: C47.1 P5.R4(TCT)
NetJ1_2: J1.2(P2) R16.2
NetJ2_2: J2.2(P2) P3.3(P3)
NetJ3_1: J3.1 U16.14(Y1)
NetJ3_3: J3.3 U16.13(Y2)
NetJ3_5: J3.5 U16.10(Y5)
NetJ5_1: J5.1(P1) U27.21(~{RCLR})
NetL3_2: L3.2 U1.131(XTL1) X1.2
NetP3_6: P3.6(P6) U12.28(DRATE0)
NetP4_2: P4.2 R33.2
NetP4_5: P4.5 R32.2
NetP5_L2: P5.L2 R36.1
NetP5_L3: P5.L3 R35.1
NetQ1_2: Q1.2(B) R26.2
NetR3_1: R3.1 U1.18(IRSET)
NetR4_1: R4.1 U1.86(~{{RAS}})
NetR5_1: R5.1 U1.85(~{{CAS}})
NetR6_2: R6.2 U1.102(~{{MCS16}})
NetR18_1: R18.1 U22.4(OUT) U22.6(IN-)
NetR20_1: R20.1 R21.1 U22.8(IN-)
NetR24_1: R24.1 R25.1 U22.14(IN-)
NetRN1_5: RN1.5 SW4.2
NetRN1_6: RN1.6 SW4.1
NetRN1_7: RN1.7 SW3.2
NetRN1_8: RN1.8 SW3.1
NetRN2_5: RN2.5 SW5.4
NetRN2_6: RN2.6 SW5.3
NetRN2_7: RN2.7 SW5.2
NetRN2_8: RN2.8 SW5.1
NetRN3_5: RN3.5 SW6.4
NetRN3_6: RN3.6 SW6.3
NetRN3_7: RN3.7 SW6.2
NetRN3_8: RN3.8 SW6.1
NetRN4_7: RN4.7 SW6.5
NetRN5_9: RN5.9 SW7.16 U28.3(Q0)
NetRN5_10: RN5.10 SW7.15 U28.5(Q1)
NetRN5_11: RN5.11 SW7.14 U28.7(Q2)
NetRN5_12: RN5.12 SW7.13 U28.9(Q3)
NetRN5_13: RN5.13 SW7.12 U28.12(Q4)
NetRN5_14: RN5.14 SW7.11 U28.14(Q5)
NetRN5_15: RN5.15 SW7.10 U28.16(Q6)
NetRN5_16: RN5.16 SW7.9 U28.18(Q7)
NetRR2_4: RR2.4 SW2.3.1 U13.7(Q2)
NetRR2_5: RR2.5 SW2.4.1 U13.9(Q3)
NetRR2_6: RR2.6 SW2.5.1 U13.12(Q4)
NetRR2_7: RR2.7 SW2.6.1 U13.14(Q5)
NetRR2_8: RR2.8 SW2.7.1 U13.16(Q6)
NetRV1_2: RV1.2 U23.3(+INPUT)
NetSW1_5: SW1.5 U7.11(Y4)
NetSW1_6: SW1.6 U7.10(Y5)
NetSW1_7: SW1.7 U7.9(Y6)
NetSW1_8: SW1.8 U7.7(Y7)
NetU1_133: U1.133(XTL2) X1.1
NetU7_5: U7.5(~{G2B}) U8.7(Y7)
NetU9_10: U9.10(RCLK) U9.17(~{{BAUDOUT}})
NetU9_18: U9.18(XIN) U10.8(OUT)
NetU16_5: U16.5(~{G2B}) U17.15(Y0)
NetU19_4: U19.4(2Y) U19.11(5A)
NetU19_6: U19.6(3Y) U19.9(4A)
NetU20_2: U20.2(1D) U20.6(1~Q)
NetU20_5: U20.5(1Q) U20.11(2CLK)
NetU20_8: U20.8(2~Q) U20.12(2D)
NetU21_2: U21.2(ToBUFF) U22.5(IN+)
NetU21_8: U21.8(MP) U22.1(IN-) U22.3(OUT)
NetU27_2: U27.2(X1) X4.1
NetU27_3: U27.3(X2) X4.2
NetU29_12: U29.12(2Y0) U30.11(5A)

Not connected (* = marked no-connect by the designer): BUS1 5(-5V)* 8(UNUSED)* 15(DACK3)* 16(DRQ3)* 17(DACK1)* 18(DRQ1)* 20(CLK)* 28(ALE)*; P1 4* 9(P9)* 11* 15*; P2 10*; P3 4(P4)* 9(P9)* 17(P17)* 27(P27)* 33(P33)*; P4 3* 4*; RN4 3* 4* 5* 6*; RR2 9*; SW2 8* 8.1*; U1 9(P7)* 10(P6)* 11(P5)* 12(P4)* 14(P3)* 15(P2)* 16(P1)* 17(P0)* 20(VREF)* 44(~{{BLANK}})* 63(RESERVED)* 99(SBHE)* 100(OUTP0)* 103(SD15)* 104(SD14)* 105(SD13)* 106(SD12)* 107(SD11)* 108(SD10)* 109(SD9)* 110(SD8)* 111(IRQ)* 112(RESERVED)* 116(LA20)* 117(LA21)* 118(LA22)* 119(LA23)* 123(RESERVED)* 127(RESERVED)* 129(DMCLK)* 132(MLF(RES))* 159(PCLK)*; U2 5(NC); U3 5(NC); U4 5(NC); U5 5(NC); U7 13(Y2)* 14(Y1)* 15(Y0)*; U8 9(Y6)* 10(Y5)* 11(Y4)* 12(Y3)* 13(Y2)* 14(Y1)* 15(Y0)*; U9 1 12 19(XOUT)* 23 26(DDIS)* 27(~{{TXRDY}})* 32(~{{RXRDY}})* 34 35(~{{OUT2}})* 38(~{{OUT1}})*; U12 29(DRATE1)* 42(NC) 43(NC) 44(NC) 47(NC) 48(MFM)* 63(ME2)* 64(DS2)* 66(ME3)* 67(DS3)*; U14 26(NC); U16 7(Y7)* 11(Y4)* 12(Y3)* 15(Y0)*; U17 7(Y7)* 9(Y6)* 10(Y5)* 11(Y4)* 12(Y3)* 13(Y2)* 14(Y1)*; U23 1(GAIN)* 8(GAIN)*; U24 48(TX-)* 49(TX+)* 53(CD-)* 54(CD+)* 55(RX-)* 56(RX+)* 60(LEDBNC)* 63(LED2/LED_TX)* 87(SD15)* 88(SD14)* 90(SD13)* 91(SD12)* 92(SD11)* 93(SD10)* 94(SD9)* 95(SD8)* 97(INT7/IRQ15)* 98(INT6/IRQ12)* 99(INT5/IRQ11)* 100(INT4/IRQ10)*; U25 7(NC); U27 1(MOT)* 22(NC)* 23(SQW)*; U29 4(1Y0) 5(1Y1) 7(1Y3) 9(2Y3) 11(2Y1); U30 2(~{1Y})* 4(~{2Y})* 6(~{3Y})* 8(~{4Y})*

## Layout directives
rule Width Constraint [Pref Width = 20mil    Min Width = 15mil    Max Width = 20mil]: +12, AVDD1, AVDD2, GND, VCC
mark named Critical Analog Path: B, G, HSYNC, MONITOR, NetC22_1, NetC23_1, NetC24_1, NetC25_1, NetC26_1, NetC27_1, R, VSYNC
differential pair: TP_RX_N, TP_RX_P, TP_TX_N, TP_TX_P

## Notes on the sheet
- (near U15) ISA SixPak Ultra, Version 1.0
- (near SW3) Config
- Switch Settings
- SW 1.1: UART uses IRQ3 (COM2, COM4)
- SW 1.2: UART uses IRQ4 (COM1, COM3)
- IO_ADDRESS
- (near SW4) IRQ
- SW 1.3: UART uses IRQ5
- SW 1.4: UART uses IRQ7
- SW 1.5: UART base address 0x2E8 (COM4)
- SW 1.6: UART base address 0x3E8 (COM3)
- SW 1.7: UART base address 0x2F8 (COM2)
- SW 1.8: UART base address 0x3F8 (COM1)
- SW 2.1: EEPROM U14 Chip Enable
- SW 2.2: EEPROM U14 Write Enable
- SW 2.3: ROM A17 = 0, otherwise 1
- (near U15) Sector QA passed
- SW 2.4: ROM A16 = 0, otherwise 1
- SW 2.5: ROM A15 = 0, otherwise 1
- SW 2.6: ROM A14 = 0, otherwise 1
- SW 2.7: ROM A13 = 0, otherwise 1
- SW 2.8: NOT USED
- J 3.1: Adlib base address 0x218
- J 3.3: Adlib base address 0x288
- J 3.5: Adlib base address 0x318
- J 3.7: Adlib base address 0x388
- (near J3) 0x218
- (near J3) 0x288
- J 4.1: Adlib uses IRQ 5
- J 4.1: Adlib uses IRQ 3
- J 4.1: Adlib uses IRQ 2(9)
- (near J3) 0x318
- 0x388
- Jumperless / RSET 8019 Config: SW 3.1 OFF, SW 3.2 ON
- Config by Switch: SW 3.1 ON, SW 3.2 OFF
- Ethernet Controller Config Mode:
- PNP: SW 3.1 OFF, SW 3.2 ON
- (near U11) Sector QA passed
- (near RN4) Sector QA passed
- IRQ 2 (XT) / IRQ 9 (AT): SW 4.1 OFF, SW 4.2 OFF
- Ethernet Controller Switches IRQ Config:
- IRQ 3: SW 4.1 ON, SW 4.2 OFF
- IRQ 4: SW 4.1 OFF, SW 4.2 ON
- (near J2) For IBM PS/2
- I/O Address
- 0x200
- Ethernet I/O Address Config:
- OFF
- SW 5.1
- IRQ 5: SW 4.1 ON, SW 4.2 OFF
- SW 5.2
- SW 5.3
- ON
- SW 5.4
- 0x220
- 0x240
- 0x260
- 0x280
- 0x2A0
- 0x2C0
- 0x2E0
- 0x300
- 0x320
- 0x340
- 0x360
- 0x380
- 0x3A0
- 0x3C0
- 0x3E0
- Ethernet Boot ROM Address (Page Mode enabled for line 15+)
- Sector QA passed
- EXP ROM
- ROM Address	ROM Size	SW4.1	SW4.2	SW4.3	SW4.4	SW4.5
  ROM Disabled	N/A	*	*	*	OFF	OFF
  0xC0000	16 KiB	OFF	OFF	OFF	OFF	ON
  0xC4000	16 KiB	ON	OFF	OFF	OFF	ON
  0xC8000	16 KiB	OFF	ON	OFF	OFF	ON
  0xCC000	16 KiB	ON	ON	OFF	OFF	ON
  0xD0000	16 KiB	OFF	OFF	ON	OFF	ON
  0xD4000	16 KiB	ON	OFF	ON	OFF	ON
  0xD8000	16 KiB	OFF	ON	ON	OFF	ON
  0xDC000	16 KiB	ON	ON	ON	OFF	ON
  0xC0000	32 KiB	OFF	OFF	OFF	ON	OFF
  0xC8000	32 KiB	ON	OFF	OFF	ON	OFF
  0xD0000	32 KiB	OFF	ON	OFF	ON	OFF
  0xD8000	32 KiB	ON	ON	OFF	ON	OFF
  0xC0000	64 KiB	OFF	OFF	ON	ON	OFF
  0xD0000	64 KiB	ON	OFF	ON	ON	OFF
  0xC0000	16 KiB	OFF	OFF	OFF	ON	ON
  0xC4000	16 KiB	ON	OFF	OFF	ON	ON
  0xC8000	16 KiB	OFF	ON	OFF	ON	ON
  0xCC000	16 KiB	ON	ON	OFF	ON	ON
  0xD0000	16 KiB	OFF	OFF	ON	ON	ON
  0xD4000	16 KiB	ON	OFF	ON	ON	ON
  0xD8000	16 KiB	OFF	ON	ON	ON	ON
  0xDC000	16 KiB	ON	ON	ON	ON	ON
- RTC IRQ Config
- (near U7) 0x2E8
- (near U7) 0x3E8
- (near U7) 0x2F8
- (near U7) 0x3F8
- RTC Address Config
- SW 7,1: AEN
- SW 7,2 - 7.8: A2-A9. Address can be calculated using standard 8088 addressing mode
- (near U24) Note: Differential Pair
- (near U13) Sector QA passed
- (near U30) Sector QA passed
- (near C41) Sector QA passed
- DWG. NO.
- REV.
- SHT.
- REVISION
- DESCRIPTION
- DATE
- APPROVED
- THIS DOCUMENT AND THE DATA DISCLOSED HEREIN OR HEREWITH IS THE PROPERTY OF ALTIUM LIMITED AND MAY BE FREELY DISTRIBUTED IN WHOLE. NO RIGHTS ARE RESERVED OR EXPRESS OR IMPLIED WARANTEE GIVEN.
- ENG:
- DSN:
- APPROVALS
- PROJECT
- DOCUMENT REVISION:
- DESIGN ITEM:
- CHK:
- BOM:
- REFERENCE DOCUMENTS
- PROJECT REVISION:
- TITLE
- FAB DWG:
- PCB DWG:
- ASSY DWG:
- SCALE:
- SIZE
- D
- CAGE CODE
- FILE NAME
- DWG NO.
- SHEET
- OF
- REV
- (in symbol RC4136N, part A) +; +VCC; -; -VCC
- (in symbol RC4136N, part B) +; -
- (in symbol RC4136N, part C) +; -
- (in symbol RC4136N, part D) +; -
- (in symbol RJMG1BD3B8K1ANR) RJ45; OUTPUT; YELLOW; C1 TX+; C2 TX-; C3 RX-; C4; C5; C6 RX-; C7; C8; GREEN

## Library data of the parts
BT1 = S8421-45R: Battery Holder (Open) Coin, 20.0mm 1 Cell SMD (SMT) Tab; MF: {'manufacturer': u'Harwin Inc.'}; MP: S8421-45R; Value: *; Package: None; Price: None; Availability: Unavailable
C1-C8 C12 C14 C40 C48 C50 CD1-CD25 CD27-CD29 CD32 = TAJR104K035RNJ: 0.1ÂµF Molded Tantalum Capacitors 35V 0805 _2012 Metric_ 29Ohm; MF: AVX; Price: None; Package: 0805 AVX; Availability: Unavailable; SnapEDA_Link: https://www.snapeda.com/parts/TAJR104K035RNJ/AVX%20/%20Kyocera/view-part/1689905/?ref=snap; Value: *; MP: TAJR104K035RNJ
C9-C11 C13 C31 C49 C51-C53 CD42 CD43 = TACR106K016XTA: Cap Tant Solid 10uF 16V R CASE 10% (2 X 1.35 X 1.35mm) SMD 2012-15 5 Ohm 125ÂÂŽ T/R; Package: None; Price: None; Value: *; MP: TACR106K016XTA; Availability: Unavailable
C15 C16 = CGA4J2X8R1H104K125AA: 0.1 ÂµF Â±10% 50V Ceramic Capacitor X8R 0805 (2012 Metric); MF: TDK; Purchase-URL: https://pricing.snapeda.com/search/part/CGA4J2X8R1H104K125AA/?ref=eda; Value: *; SnapEDA_Link: https://www.snapeda.com/parts/CGA4J2X8R1H104K125AA/TDK/view-part/?ref=snap; Package: 2012 TDK; MP: CGA4J2X8R1H104K125AA; Digi-Key_Part_Number: 445-5909-2-ND; Check_prices: https://www.snapeda.com/parts/CGA4J2X8R1H104K125AA/TDK/view-part/?ref=eda
C17 = C0805C101J5RAC7800: Package: None; Price: None; Value: *; MP: C0805C101J5RAC7800; Availability: Unavailable
C18-C24 C26 C27 = 08055A470JAT2A: Capacitor: ceramic; 47pF; 50V; C0G; Â±5%; SMD; Case (inch):0805; Package: None; Price: None; Value: *; MP: 08055A470JAT2A; Availability: Unavailable
C25 = CC0805KFX7R8BB105: 1ÂµF Â±10% 25V Ceramic Capacitor X7R 0805 (2012 Metric); MF: Yageo; MP: CC0805KFX7R8BB105; SnapEDA_Link: https://www.snapeda.com/parts/CC0805KFX7R8BB105/Yageo/view-part/1817011/?ref=snap; Mouser-Purchase-URL: https://snapeda.com/shop?store=Mouser&id=1817011; Price: None; Availability: Good; Package: 0805 Yageo; Value: *; Arrow_Electronics-Purchase-URL: https://snapeda.com/shop?store=Arrow+Electronics&id=1817011; BuyPart: https://www.snapeda.com/parts/CC0805KFX7R8BB105/Yageo/view-part/1817011/?ref=eda
C28 C29 = CMP-2007-01412-1: Manufacturer: Vitramon; Part Number: VJ0805A220KXJPW1BC
C30 C32-C35 = C0805C472J2GAC7800: Package: None; Price: None; Value: *; MP: C0805C472J2GAC7800; Availability: Unavailable
C36 = TACR475M020XTA: 4.7uF SMD Solid MnO2 Tantalum Electrolytic Capacitor, 20 V dc +/-20%, TAC Series; Package: None; Price: None; Value: *; MP: TACR475M020XTA; Availability: Unavailable
C37 C41 = TAJC106J016RNJ: 10ÂµF Molded Tantalum Capacitors 16V 2312 (6032 Metric) 2Ohm; MF: AVX; MP: TAJC106J016RNJ; Availability: Bad; Package: 2312 AVX; SnapEDA_Link: https://www.snapeda.com/parts/TAJC106J016RNJ/AVX/view-part/1684768/?ref=snap; Check_prices: https://www.snapeda.com/parts/TAJC106J016RNJ/AVX/view-part/1684768/?ref=eda; Value: *; Price: None; Purchase-URL: https://pricing.snapeda.com/search/part/TAJC106J016RNJ/?ref=eda
C38 = 0805YC102JAT2A: CAP CER 1000PF 16V 5% X7R 0805; Package: None; Price: None; Value: *; MP: 0805YC102JAT2A; Availability: Unavailable
C39 = C0805C271F5GACTU: CAP, MLCC, C0G, 270PF, 50V, 0805; Package: None; Price: None; Value: *; MP: C0805C271F5GACTU; Availability: Unavailable
C42 = CGA4C2C0G1H472J060AA: 4700 pF Â±5% 50V Ceramic Capacitor C0G, NP0 0805 (2012 Metric); MF: TDK; Availability: In Stock; Purchase-URL: https://pricing.snapeda.com/search/part/CGA4C2C0G1H472J060AA/?ref=eda; SnapEDA_Link: https://www.snapeda.com/parts/CGA4C2C0G1H472J060AA/TDK/view-part/?ref=snap; Price: None; Check_prices: https://www.snapeda.com/parts/CGA4C2C0G1H472J060AA/TDK/view-part/?ref=eda; Package: 2012 TDK; MP: CGA4C2C0G1H472J060AA; Value: *
C43 = ECA1CM471: 470F 16V Aluminum Electrolytic Capacitors Radial, Can 2000 Hrs @ 85C; MF: Panasonic; Package: RADIAL-2 Panasonic; Check_prices: https://www.snapeda.com/parts/ECA1CM471/Panasonic/view-part/5788233/?ref=eda; Value: *; Price: None; MP: ECA1CM471; SnapEDA_Link: https://www.snapeda.com/parts/ECA1CM471/Panasonic/view-part/5788233/?ref=snap; Availability: No availability data
C44 C45 = C0805C100K4HACAUTO: Package: None; Price: None; Value: *; MP: C0805C100K4HACAUTO; Availability: Unavailable
C46 C47 = C0805C103J4RAC7800: Package: None; Price: None; Value: *; MP: C0805C103J4RAC7800; Availability: Unavailable
D1 = 1N4148: Small Signal Fast Switching Diodes; Price: None; MP: 1N4148; Availability: Unavailable; Value: *; Package: None
J1 J2 J5 = 640452-2: Header, Friction Lock; MTA-100; 2; 250 VAC; Polyester; Tin; Copper Alloy; Tin; Centerline_Pitch: 2.54 mm[.1 in]; MF: TE Connectivity; Number_of_Positions: 2; Product_Type: Connector; SnapEDA_Link: https://www.snapeda.com/parts/640452-2/TE%20Connectivity%20AMP%20Connectors/view-part/2877927/?ref=snap; Digi-Key_Part_Number: A1911-ND; Value: *; MP: 640452-2; Digi-Key_Purchase_URL: https://www.digikey.com/product-detail/en/te-connectivity-amp-connectors/640452-2/A1911-ND/108973?utm_source=snapeda&utm_medium=aggregator&utm_campaign=symbol; Package: None; TE_purchase_URL: https://www.te.com/usa-en/product-640452-2.html?te_bu=Cor&te_type=disp&te_campaign=seda_glo_cor-seda-global-disp-prtnr-fy19-seda-model-bom-cta_sma-317_1&elqCampaignId=32493
J3 = SAMTEC-TSM-104-01-X-DV-AJ: GateName_1: A; SymbolName_1: SAMTEC-TSM-104-01-X-DV-AA; DeviceName: J; LibraryName: SAMTEC-TSM-104-01-X-DV-A; DeviceSetName: SAMTEC-TSM-104-01-X-DV-A; Package: SAMTEC-TSM-104-01-X-DV-A
J4 = TSM-103-01-T-DV: MF: Samtec; MP: TSM-103-01-T-DV; Value: *; Availability: Unavailable; Package: None; Price: None
L1-L3 = 78F5R6J-RC: No Description Available; Mfr_Name: Bourns Electronics; Type: DEV; Copyright: Copyright (C) 2022 Ultra Librarian. All rights reserved.; Manufacturer_Part_Number: 78F5R6J-RC; Digi-Key_Part_Number_1: 78F5R6J-RC-ND; RefDes: RefDes
P1 = DE15: Value: VGA; Footprint: my_components:Conn_Dsub_DE15F
P2 = 61201021621: <b> WR-BHD 2.54mm Male Box Header, 10 Pins</b>=>Code : Con_WTB_BHD_2.54_Male_THT_WS_61201021621 <br><a href="http://katalog.we-online.de/media/thumbs2/eican/thb_Con_WTB_BHD_2.54_Male_THT_WS_6120xx21621_pf2.jpg" title="Enlarge picture"> <img src="http://katalog.we-online.de/media/thumbs2/eican/thb_Con_WTB_BHD_2.54_Male_THT_WS_6120xx21621_pf2.jpg"  width="320"></a><p> Details see: <a href="http://katalog.we-online.de/en/em/612_0xx_216_21">http://katalog.we-online.de/en/em/612_0xx_216_21</a><p> Created 2014-06-04, Karrer Zheng<br> 2014 (C) WÃ¼rth Elektronik; MF: {'manufacturer': u'Wurth Elektronik'}; Price: None; Value: *; Package: None; Availability: Unavailable; MP: 61201021621
P3 = CONN_17X2: Value: FLOPPY
P4 = CONN_5: Value: AUDIO_OUT
P5 = RJMG1BD3B8K1ANR: 1 Port RJ45 Magjack Connector Through Hole 10/100 Base-T, AutoMDIX; MF: Amphenol ICC; SnapEDA_Link: https://www.snapeda.com/parts/RJMG1BD3B8K1ANR/Amphenol%20FCI/view-part/1683132/?ref=snap; Digi-Key_Part_Number: RJMG1BD3B8K1ANR-ND; Value: *; Digi-Key_Purchase_URL: https://www.digikey.com/product-detail/en/amphenol-icc-commercial-products/RJMG1BD3B8K1ANR/RJMG1BD3B8K1ANR-ND/5359794?utm_source=snapeda&utm_medium=aggregator&utm_campaign=symbol; Package: None; MP: RJMG1BD3B8K1ANR
R1 = ERJ6ENF1000V: MP: ERJ6ENF1000V; Package: None; Availability: Unavailable; Price: None; Value: *
R2 = AC0805FR-101KL: 1 kOhms Â±1% 0.125W, 1/8W Chip Resistor 0805 (2012 Metric) Automotive AEC-Q200 Thick Film; MF: YAGEO; Purchase-URL: https://pricing.snapeda.com/search/part/AC0805FR-101KL/?ref=eda; Package: None; MP: AC0805FR-101KL; Digi-Key_Part_Number: 13-AC0805FR-101KLTR-ND; Value: *; Check_prices: https://www.snapeda.com/parts/AC0805FR-101KL/Yageo/view-part/?ref=eda; SnapEDA_Link: https://www.snapeda.com/parts/AC0805FR-101KL/Yageo/view-part/?ref=snap
R3 R7-R9 = ERJ-6GEYJ151V: Res Thick Film 0805 150 Ohm 5% 0.125W(1/8W) Â}200ppm/ÂÂŽ Molded SMD Automotive T/R; Package: None; Price: None; Value: *; MP: ERJ-6GEYJ151V; Availability: Unavailable
R4 R5 = RMCF0805JT33R0: Package: None; Price: None; Value: *; MP: RMCF0805JT33R0; Availability: Unavailable
R6 R10-R16 = RC0805FR-074K7L: 4.7 kOhms Â±1% 0.125W, 1/8W Chip Resistor 0805 _2012 Metric_ Moisture Resistant Thick Film; MF: Yageo; Value: *; Package: 2012 Rohm Semiconductor; Digi-Key_Purchase_URL: https://www.digikey.com.eg/product-detail/en/yageo/RC0805FR-074K7L/311-4.70KCRCT-ND/730876?utm_source=snapeda&utm_medium=aggregator&utm_campaign=symbol; Digi-Key_Part_Number: 311-4.70KCRCT-ND; SnapEDA_Link: https://www.snapeda.com/parts/RC0805FR-074K7L/Yageo/view-part/523399/?ref=snap; MP: RC0805FR-074K7L
R17 = AC0805JR-072K2L: AC0805 2,2K 5% 0,125W AUTOMO; Package: None; Price: None; Value: *; MP: AC0805JR-072K2L; Availability: Unavailable
R18 R19 R22 R23 R26 R27 = ERJ-PB6B2201V: Package: None; Price: None; Value: *; MP: ERJ-PB6B2201V; Availability: Unavailable
R20 = ERJ-PB6B1202V: Package: None; Price: None; Value: *; MP: ERJ-PB6B1202V; Availability: Unavailable
R21 R25 R28 R31 = ERJ-PB6B1002V: 10 kOhms Â±0.1% 0.25W, 1/4W Chip Resistor 0805 (2012 Metric) Automotive AEC-Q200, Pulse Withstanding Thick Film; MF: Panasonic Electronic; MP: ERJ-PB6B1002V; Value: *; Package: 2012 Panasonic Electronic Components; SnapEDA_Link: https://www.snapeda.com/parts/ERJ-PB6B1002V/Panasonic%20Electronic%20Components/view-part/3737287/?ref=snap; Digi-Key_Part_Number: P20708CT-ND; Check_prices: https://www.snapeda.com/parts/ERJ-PB6B1002V/Panasonic%20Electronic%20Components/view-part/3737287/?ref=eda
R24 = ERJ-PB6B1501V: Res Thick Film 0805 1.5K Ohm 0.1% 0.25W(1/4W) Â±50ppm/C Pad SMD Automotive T/R; Package: None; Price: None; Value: *; MP: ERJ-PB6B1501V; Availability: Unavailable
R29 R30 R32-R34 = ERJ-PB6B8201V: Package: None; Price: None; Value: *; MP: ERJ-PB6B8201V; Availability: Unavailable
R35 R36 = ERJ-PB6B4700V: Package: None; Price: None; Value: *; MP: ERJ-PB6B4700V; Availability: Unavailable
R37 = RK73H2ARTTD2702F: Res Thick Film 0805 27K Ohm 1% 0.25W(1/4W) Â±100ppm/Â°C Sulfur Resistant Pad SMD Automotive T/R; MF: {'manufacturer': u'KOA Speer'}; Package: None; MP: RK73H2ARTTD2702F; Price: None; Value: *; Availability: Unavailable
R38 = ERJ-PB6B2000V: Res Thick Film 0805 200 Ohm 0.1% 0.25W(1/4W) Â±50ppm/C Pad SMD Automotive T/R; MF: {'manufacturer': u'Panasonic'}; Value: *; Availability: Unavailable; Package: None; MP: ERJ-PB6B2000V; Price: None
RN1-RN4 = EXB-38V103JV: Res Thick Film Array 470 Ohm 5% ?200ppm/C ISOL Molded 8-Pin 1206(4 X 0603) Convex SMD Automotive T/R; MF: {'manufacturer': u'Panasonic'}; MP: EXB-38V103JV; Package: None; Availability: Unavailable; Price: None; Value: *
RN5 = 4816P-1-103LF: Res Thick Film NET 68K Ohm 2% 1.28W Â±100ppm/C ISOL Molded 16-Pin SOM Gull Wing SMD Automotive T/R; MF: {'manufacturer': u'Bourns'}; Package: None; MP: 4816P-1-103LF; Value: *; Availability: Unavailable; Price: None
RR1 = RR5: Value: 1k
RR2 = RR9: Value: 10k
RV1 = POT: Value: 10k
SW1 SW2 = 1-1825058-9: AD Series 8 Position SPST Extended Slide Non Sealed 2.54 mm Pitch SMT DIP Switch; MF: TE Connectivity; Value: *; TE_purchase_URL: https://www.te.com/usa-en/product-1-1825058-9.html?te_bu=Cor&te_type=disp&te_campaign=seda_glo_cor-seda-global-disp-prtnr-fy19-seda-model-bom-cta_sma-317_1&elqCampaignId=32493; Package: DIP-4 TE Connectivity; Price: None; MP: 1-1825058-9; Availability: Unavailable; SnapEDA_Link: https://www.snapeda.com/parts/1-1825058-9/TE%20Connectivity%20ALCOSWITCH%20Switches/view-part/52148/?ref=snap; EU_RoHS_Compliance: Compliant
SW3 SW4 = 1825059-1: SPST Flush Slide Sealed 2.54 mm Pitch Surface Mount DIP Switch; MF: {'manufacturer': u'TE Connectivity'}; MP: 1825059-1; Availability: Unavailable; Package: None; Value: *; Price: None
SW5 = 1-1825059-7: SPST Flush Slide Sealed 2.54 mm Pitch Surface Mount DIP Switch; MF: {'manufacturer': u'TE Connectivity'}; Package: None; MP: 1-1825059-7; Value: *; Availability: Unavailable; Price: None
SW6 = 2-1825059-3: SPST Flush Slide Sealed 2.54 mm Pitch Surface Mount DIP Switch; MF: {'manufacturer': u'TE Connectivity'}; Value: *; MP: 2-1825059-3; Availability: Unavailable; Price: None; Package: None
SW7 = 4-1825059-1: SPST Flush Slide Sealed 2.54 mm Pitch Surface Mount DIP Switch; MF: {'manufacturer': u'TE Connectivity'}; MP: 4-1825059-1; Price: None; Package: None; Value: *; Availability: Unavailable
SW8 = DS04-254-2-06BK-SMT-TR: MF: {'manufacturer': u'CUI Devices'}; Value: *; Availability: Unavailable; Price: None; Package: None; MP: DS04-254-2-06BK-SMT-TR
U10 = OSC: Value: 1.8432MHz
U18 = SN74LS245DW: Octal bus transceivers 20-SOIC 0 to 70; MF: Texas Instruments; Package: SOIC-20 Texas Instruments; MP: SN74LS245DW; Purchase-URL: https://pricing.snapeda.com/search/part/SN74LS245DW/?ref=eda; Check_prices: https://www.snapeda.com/parts/SN74LS245DW/Texas%20Instruments/view-part/564932/?ref=eda; Value: *; Digi-Key_Part_Number: 296-1214-2-ND; SnapEDA_Link: https://www.snapeda.com/parts/SN74LS245DW/Texas%20Instruments/view-part/564932/?ref=snap
U19 = SN74LS04DR: 6-ch, 4.75-V to 5.25-V bipolar inverters; MF: Texas Instruments; Value: *; MP: SN74LS04DR; Package: SOIC-14 Texas Instruments; Purchase-URL: https://pricing.snapeda.com/search/part/SN74LS04DR/?ref=eda; Availability: In Stock; Check_prices: https://www.snapeda.com/parts/SN74LS04DR/Texas+Instruments/view-part/?ref=eda; SnapEDA_Link: https://www.snapeda.com/parts/SN74LS04DR/Texas+Instruments/view-part/?ref=snap; Price: None
U20 = SN74LS74AD: Dual D-type pos.-edge-triggered flip-flops with preset and clear 14-SOIC 0 to 70; MF: Texas Instruments; MP: SN74LS74AD; Value: *; SnapEDA_Link: https://www.snapeda.com/parts/SN74LS74AD/Texas%20Instruments/view-part/580890/?ref=snap; Price: None; Package: SOIC-14 Texas Instruments; Check_prices: https://www.snapeda.com/parts/SN74LS74AD/Texas%20Instruments/view-part/580890/?ref=eda; Availability: Good; Purchase-URL: https://pricing.snapeda.com/search/part/SN74LS74AD/?ref=eda
U22 = RC4136N: Quad general purpose 30V operational amplifier 14-PDIP 0 to 70; MF: Texas Instruments; Package: PDIP-14 Texas Instruments; Check_prices: https://www.snapeda.com/parts/RC4136N/Texas%20Instruments/view-part/568586/?ref=eda; Purchase-URL: https://pricing.snapeda.com/search/part/RC4136N/?ref=eda; Price: None; MP: RC4136N; Value: *; Availability: Good; SnapEDA_Link: https://www.snapeda.com/parts/RC4136N/Texas%20Instruments/view-part/568586/?ref=snap
U23 = LM386MX-1/NOPB: Wide Input Voltage Low Power Audio Amplifier with Internal Gain; MF: Texas Instruments; Availability: Unavailable; Package: SOIC-8 Texas Instruments; Value: *; SnapEDA_Link: https://www.snapeda.com/parts/LM386MX-1/NOPB/Texas%20Instruments/view-part/216475/?ref=snap; MP: LM386MX-1/NOPB; Price: None; Texas_Instruments-Purchase-URL: https://snapeda.com/shop?store=Texas+Instruments&id=216475
U25 = 93LCxxC: Value: 93LC46C; Footprint: Package_SO:SO-8_3.9x4.9mm_P1.27mm
U27 = DS12885: MF: {'manufacturer': u'Maxim Integrated'}; Package: None; MP: DS12885; Value: *; Availability: Unavailable; Price: None
U28 = SN74LS688DW: MF: {'manufacturer': u'Texas Instruments'}; Value: *; Availability: Unavailable; Price: None; Package: None; MP: SN74LS688DW
U29 = SN74HCT139D: MF: {'manufacturer': u'Texas Instruments'}; MP: SN74HCT139D; Price: None; Package: None; Value: *; Availability: Unavailable
U30 = CD74HC04M: MF: {'manufacturer': u'Texas Instruments'}; Value: *; Availability: Unavailable; Price: None; Package: None; MP: CD74HC04M
X2 = ECS-240-12-20A-TR: SMD CRYSTAL; MF: {'manufacturer': u'ECS Inc.'}; Value: *; Availability: Unavailable; Package: None; MP: ECS-240-12-20A-TR; Price: None
X3 = ABM3-20.000MHZ-B2-T: 20 MHz Â±20ppm Crystal 18pF 30 Ohms 2-SMD, No Lead; MF: Abracon; MP: ABM3-20.000MHZ-B2-T; SnapEDA_Link: https://www.snapeda.com/parts/ABM3-20.000MHZ-B2-T/Abracon+LLC/view-part/?ref=snap; Price: None; Purchase-URL: https://pricing.snapeda.com/search/part/ABM3-20.000MHZ-B2-T/?ref=eda; Package: SMD-2 Abracon; Availability: In Stock; Value: *; Check_prices: https://www.snapeda.com/parts/ABM3-20.000MHZ-B2-T/Abracon+LLC/view-part/?ref=eda
X4 = MS1V-T1K-32.768KHZ-7PF-20PPM-TA-QC-AU: Tuning Fork Crystal 30 kHz â€“ 200 kHz; MF: {'manufacturer': u'Micro Crystal'}; Value: *; MP: MS1V-T1K-32.768KHZ-7PF-20PPM-TA-QC-AU; Availability: Unavailable; Price: None; Package: None
BUS1 = BUSPC_DEV: Value: BUSPC_DEV; Footprint: my_components:Conn_Edge_ISA8
FB1-FB6 = FILTER: Value: FILTER; Footprint: my_components:Res_1016
Q1 = 2N3904: Package: None; Price: None; Availability: Unavailable; MP: 2N3904; Value: *
U1 = TVGA9000I: Value: TVGA9000I
U2-U5 = MT4C4256: Value: MT4C4256; Footprint: my_components:IC_DIP20_300
U6 = 27C256: Value: 27C256; Footprint: my_components:IC_DIP28_600
U7 U8 U16 U17 = SN74ALS138ADR: Package: None; Price: None; Value: *; MP: SN74ALS138ADR; Availability: Unavailable
U9 = 16550-PLCC: Value: 16550-PLCC
U11 = GD75232: Value: GD75232
U12 = 82077AA: Value: 82077AA
U13 = SN74LS688DW: Package: None; Price: None; Value: *; MP: SN74LS688DW; Availability: Unavailable
U14 = 28C64: Value: 28C64
U15 = YM3812: Value: YM3812
U21 = Y3014B: Value: Y3014B
U24 = RTL8019AS: Value: RTL8019AS; Footprint: My_Components:IC_PQFP-100_14x20mm_P0.65mm_Hand_Soldering
U26 = SST39SF040: Value: SST39SF040; Footprint: My_Components:Socket_DIP32_600
X1 = ABM3-40.000MHZ-B2-T: MP: ABM3-40.000MHZ-B2-T; Availability: Unavailable; Package: None; Price: None; Value: *